# EAGLE design MotorBoardDev (EAGLE 8.4.0)
IGVC Motor Control Board
REVISION: v1.1; SCH_DESC: Motor Control Board; TEAM: IGVC

## Sheet 1 of 4: mBed Breakout
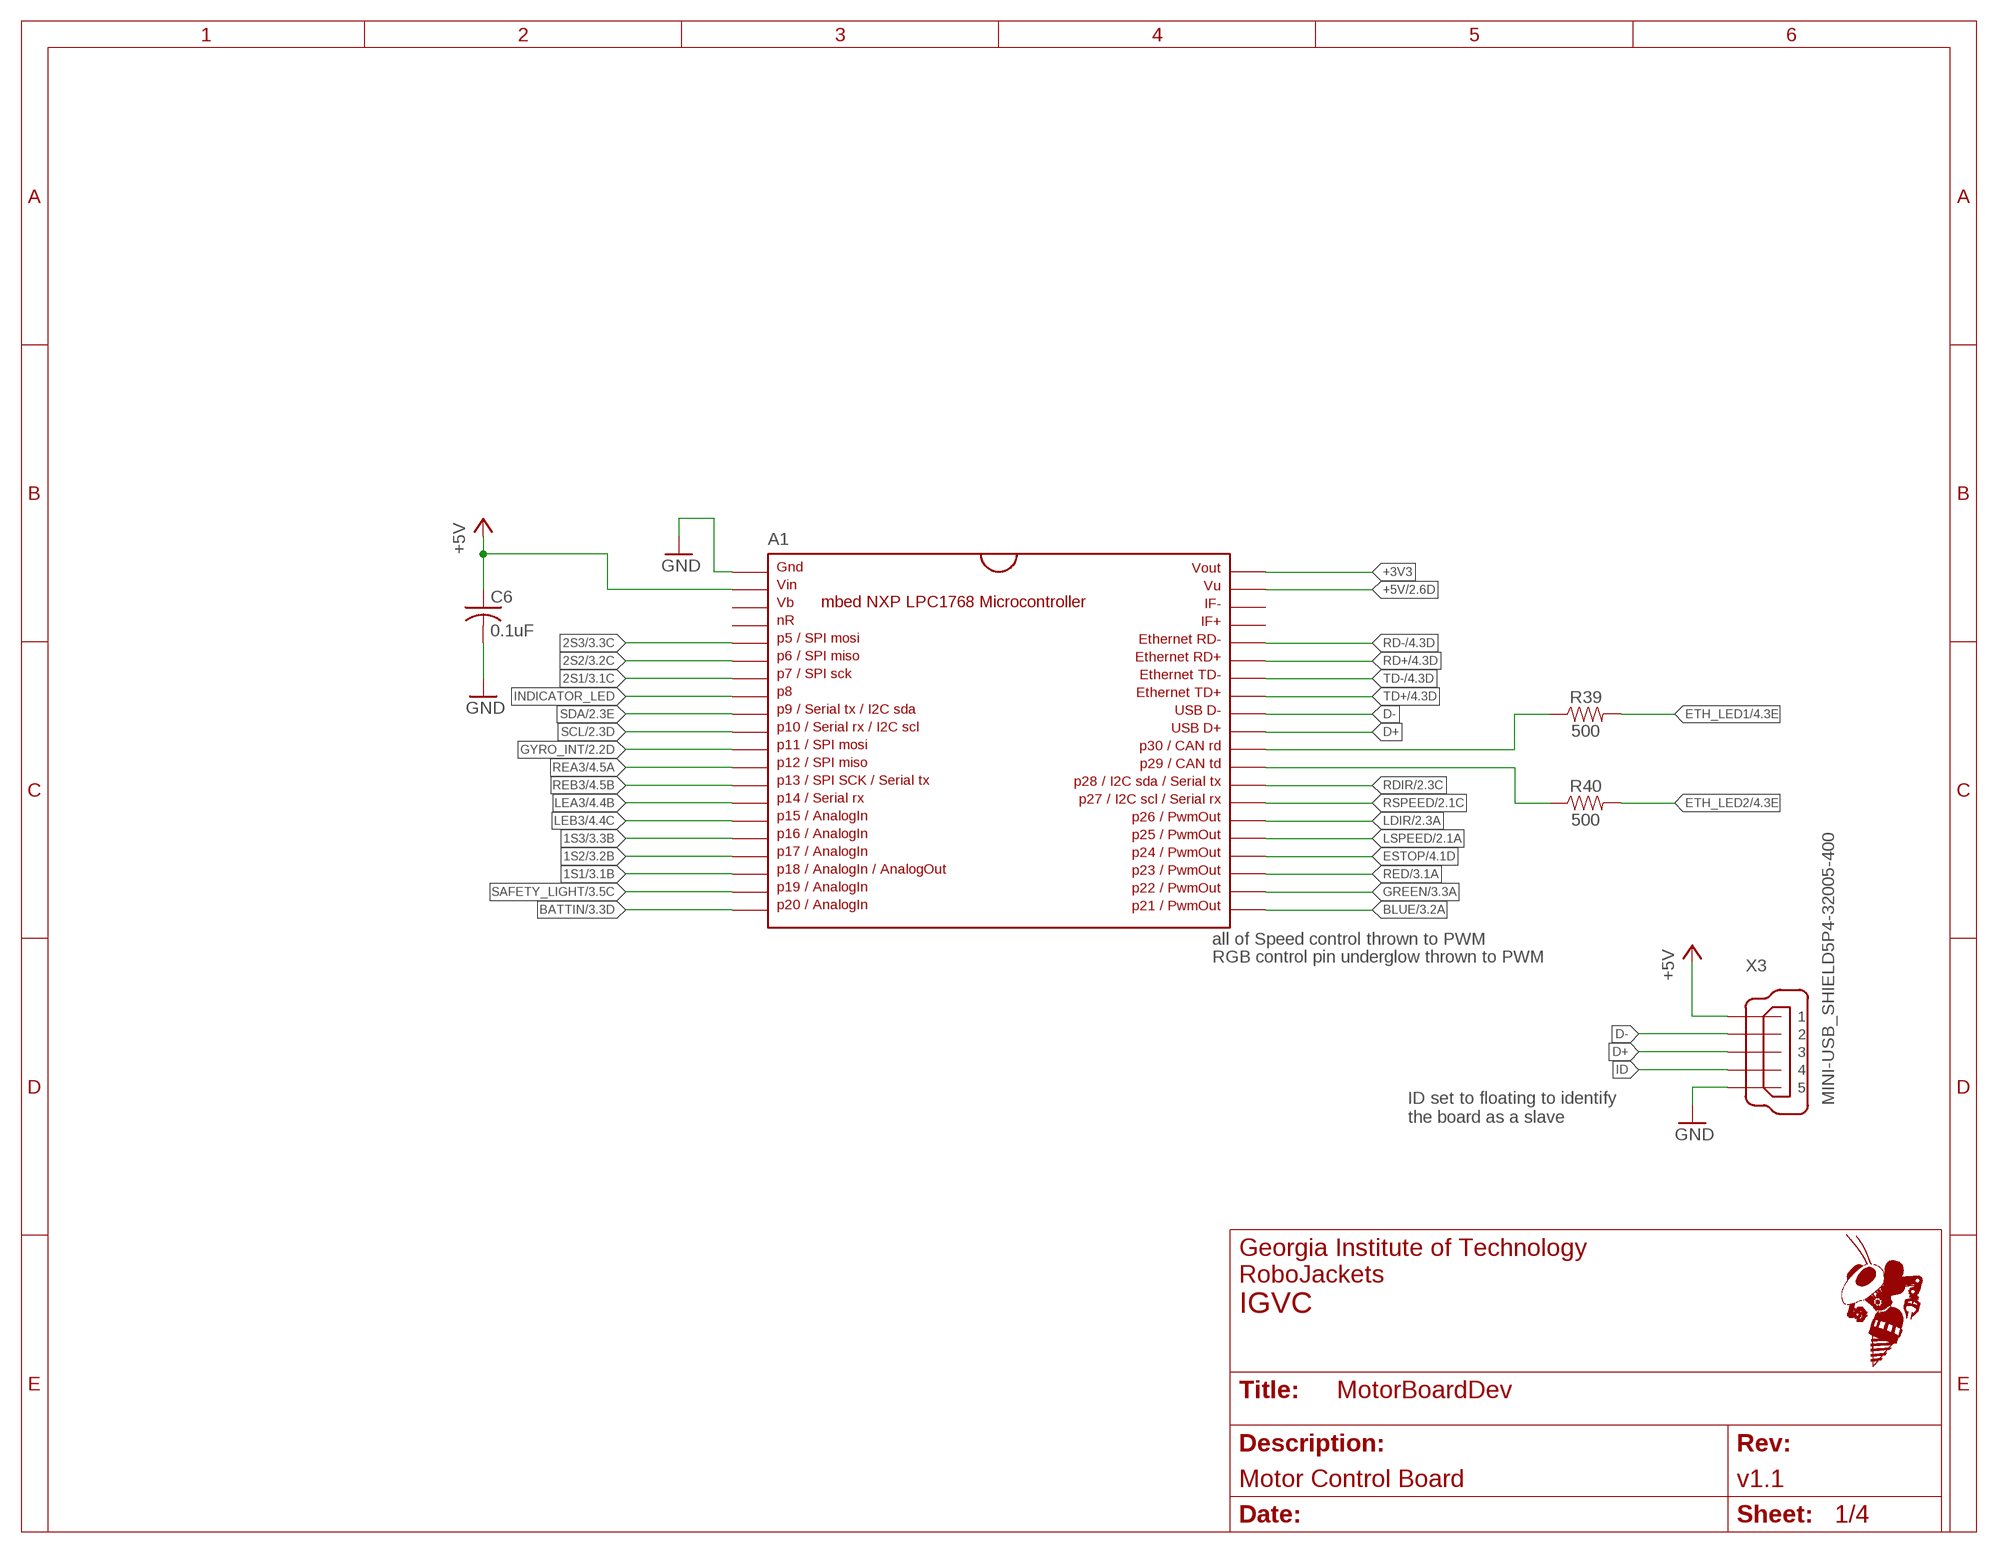
[diagram p0: schematic, sheet 1]

### Parts
A1  MBED1768  SPARKFUN-BOARDS_MBED_NXP_LPC1768  [SPARKFUN-BOARDS_DIL40_0.9]
C6  0.1uF  C-USC0603  [C0603]
R39  500  1KOHM-0603-1/10W-1%  [0603]
R40  500  1KOHM-0603-1/10W-1%  [0603]
X3  MINI-USB_SHIELD5P4-32005-400  [32005-400]

### Nets
1S1: A1.18 ; also sheet 3
1S2: A1.17 ; also sheet 3
1S3: A1.16 ; also sheet 3
2S1: A1.7 ; also sheet 3
2S2: A1.6 ; also sheet 3
2S3: A1.5 ; also sheet 3
+3V3: A1.40 ; also sheet 2,3,4
+5V: A1.2 A1.39 C6.1 X3.1 ; also sheet 2,3,4
BATTIN: A1.20 ; also sheet 3
BLUE: A1.21 ; also sheet 3
D+: A1.31 X3.3
D-: A1.32 X3.2
ESTOP: A1.24 ; also sheet 4
ETH_LED1: R39.2 ; also sheet 4
ETH_LED2: R40.2 ; also sheet 4
GND: A1.1 C6.2 X3.5 ; also sheet 2,3,4
GREEN: A1.22 ; also sheet 3
GYRO_INT: A1.11 ; also sheet 2
ID: X3.4
INDICATOR_LED: A1.8
LDIR: A1.26 ; also sheet 2
LEA3: A1.14 ; also sheet 4
LEB3: A1.15 ; also sheet 4
LSPEED: A1.25 ; also sheet 2
N$37: A1.30 R39.1
N$38: A1.29 R40.1
RD+: A1.35 ; also sheet 4
RD-: A1.36 ; also sheet 4
RDIR: A1.28 ; also sheet 2
REA3: A1.12 ; also sheet 4
REB3: A1.13 ; also sheet 4
RED: A1.23 ; also sheet 3
RSPEED: A1.27 ; also sheet 2
SAFETY_LIGHT: A1.19 ; also sheet 3
SCL: A1.10 ; also sheet 2
SDA: A1.9 ; also sheet 2
TD+: A1.33 ; also sheet 4
TD-: A1.34 ; also sheet 4
Unconnected: A1.3 A1.4 A1.37 A1.38 X3.M1(S1) X3.M2(S2) X3.M3(S3) X3.M4(S4)

### Notes on the sheet
- all of Speed control thrown to PWM
- RGB control pin underglow thrown to PWM
- ID set to floating to identify 
  the board as a slave

## Sheet 2 of 4: Motor Control
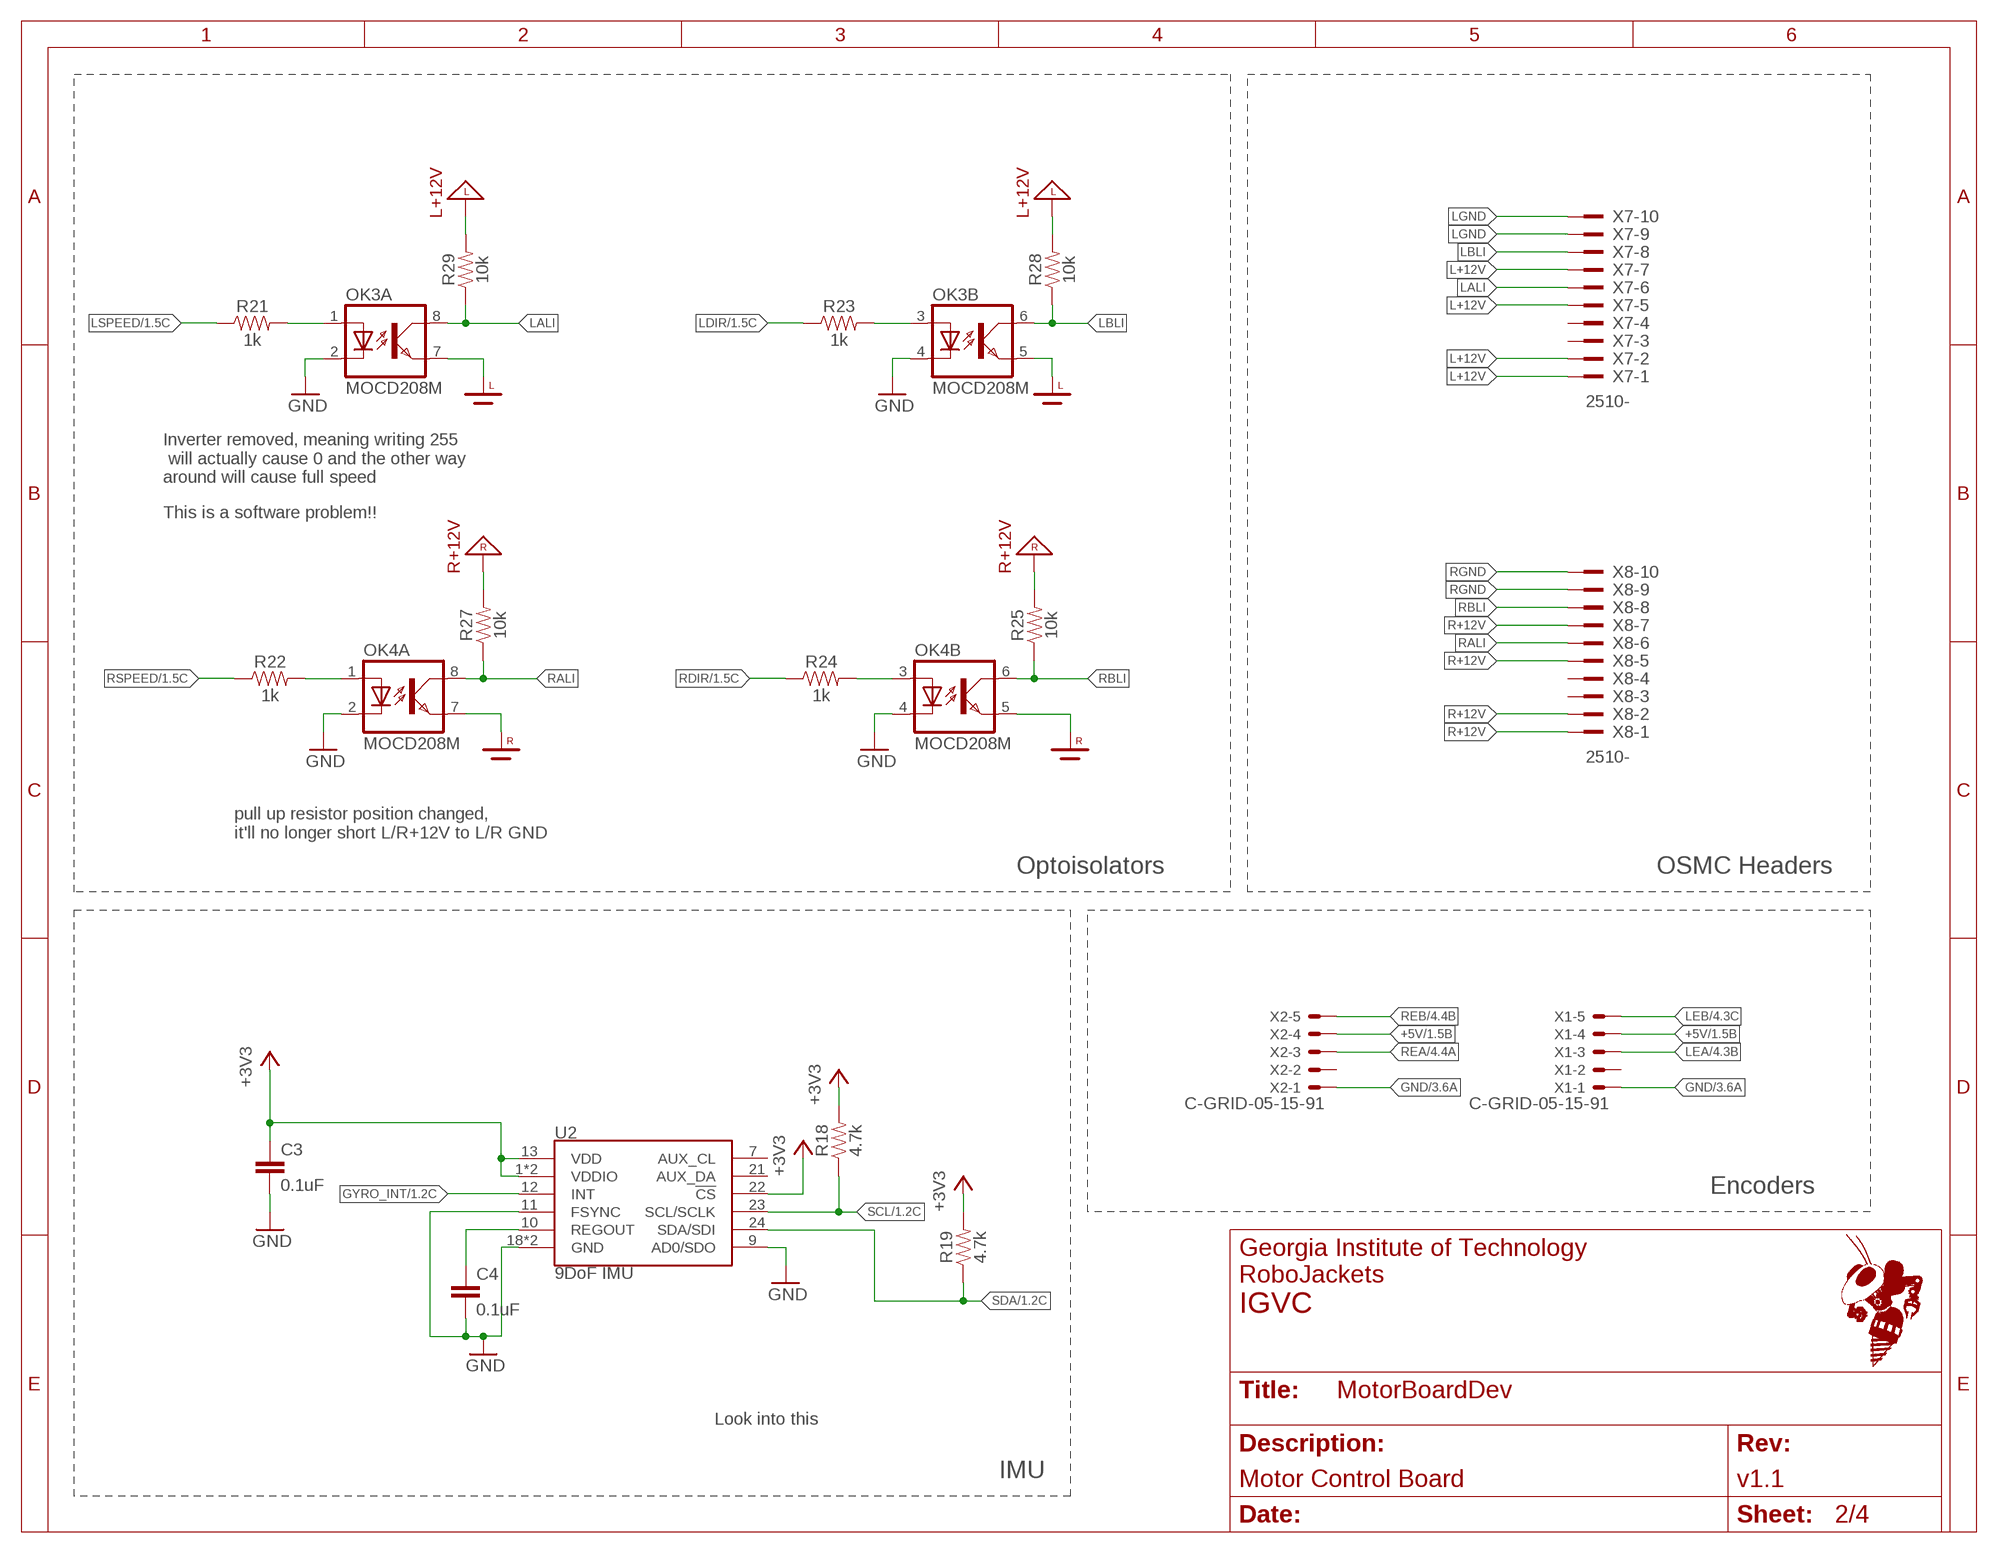
[diagram p1: schematic, sheet 2]

### Parts
C3  0.1uF  0.1UF-0603-25V-(+80/-20%)  [0603]
C4  0.1uF  0.1UF-0603-25V-(+80/-20%)  [0603]
OK3  MOCD208M  [SOIC08-FAIRCHILD]
OK4  MOCD208M  [SOIC08-FAIRCHILD]
R18  4.7k  4.7KOHM-0603-1/10W-1%  [0603]
R19  4.7k  4.7KOHM-0603-1/10W-1%  [0603]
R21  1k  1KOHM-0603-1/10W-1%  [0603]
R22  1k  1KOHM-0603-1/10W-1%  [0603]
R23  1k  1KOHM-0603-1/10W-1%  [0603]
R24  1k  1KOHM-0603-1/10W-1%  [0603]
R25  10k  10KOHM-0603-1/10W-1%  [0603]
R27  10k  10KOHM-0603-1/10W-1%  [0603]
R28  10k  10KOHM-0603-1/10W-1%  [0603]
R29  10k  10KOHM-0603-1/10W-1%  [0603]
U2  9DoF IMU  MPU-9250  [QFN24-3X3]
X1  C-GRID-05-15-91  [15-91-05]
X2  C-GRID-05-15-91  [15-91-05]
X7  2510-  [PAK100/2500-10]
X8  2510-  [PAK100/2500-10]

### Nets
+3V3: C3.1 R18.2 R19.2 U2.1(VDDIO) U2.8(VDDIO) U2.13(VDD) U2.22(!CS) ; also sheet 1,3,4
+5V: X1.4 X2.4 ; also sheet 1,3,4
GND: C3.2 C4.2 OK3.2(A:C) OK3.4(B:C) OK4.2(A:C) OK4.4(B:C) U2.9(AD0/SDO) U2.11(FSYNC) U2.18(GND) U2.20(GND) X1.1 X2.1 ; also sheet 1,3,4
GYRO_INT: U2.12(INT) ; also sheet 1
L+12V: R28.2 R29.2 X7.1 X7.2 X7.5 X7.7
LALI: OK3.8(A:COL) R29.1 X7.6
LBLI: OK3.6(B:COL) R28.1 X7.8
LDIR: R23.1 ; also sheet 1
LEA: X1.3 ; also sheet 4
LEB: X1.5 ; also sheet 4
LGND: OK3.5(B:EMIT) OK3.7(A:EMIT) X7.9 X7.10
LSPEED: R21.1 ; also sheet 1
N$2: C4.1 U2.10(REGOUT)
N$29: OK3.1(A:A) R21.2
N$30: OK4.1(A:A) R22.2
N$31: OK4.3(B:A) R24.2
N$32: OK3.3(B:A) R23.2
R+12V: R25.2 R27.2 X8.1 X8.2 X8.5 X8.7
RALI: OK4.8(A:COL) R27.1 X8.6
RBLI: OK4.6(B:COL) R25.1 X8.8
RDIR: R24.1 ; also sheet 1
REA: X2.3 ; also sheet 4
REB: X2.5 ; also sheet 4
RGND: OK4.5(B:EMIT) OK4.7(A:EMIT) X8.9 X8.10
RSPEED: R22.1 ; also sheet 1
SCL: R18.1 U2.23(SCL/SCLK) ; also sheet 1
SDA: R19.1 U2.24(SDA/SDI) ; also sheet 1
Unconnected: U2.7(AUX_CL) U2.21(AUX_DA) X1.2 X2.2 X7.3 X7.4 X8.3 X8.4

### Notes on the sheet
- Inverter removed, meaning writing 255
   will actually cause 0 and the other way 
  around will cause full speed
- This is a software problem!!
- pull up resistor position changed,
  it'll no longer short L/R+12V to L/R GND
- Optoisolators | OSMC Headers
- Encoders
- Look into this
- IMU

## Sheet 3 of 4: Light Control
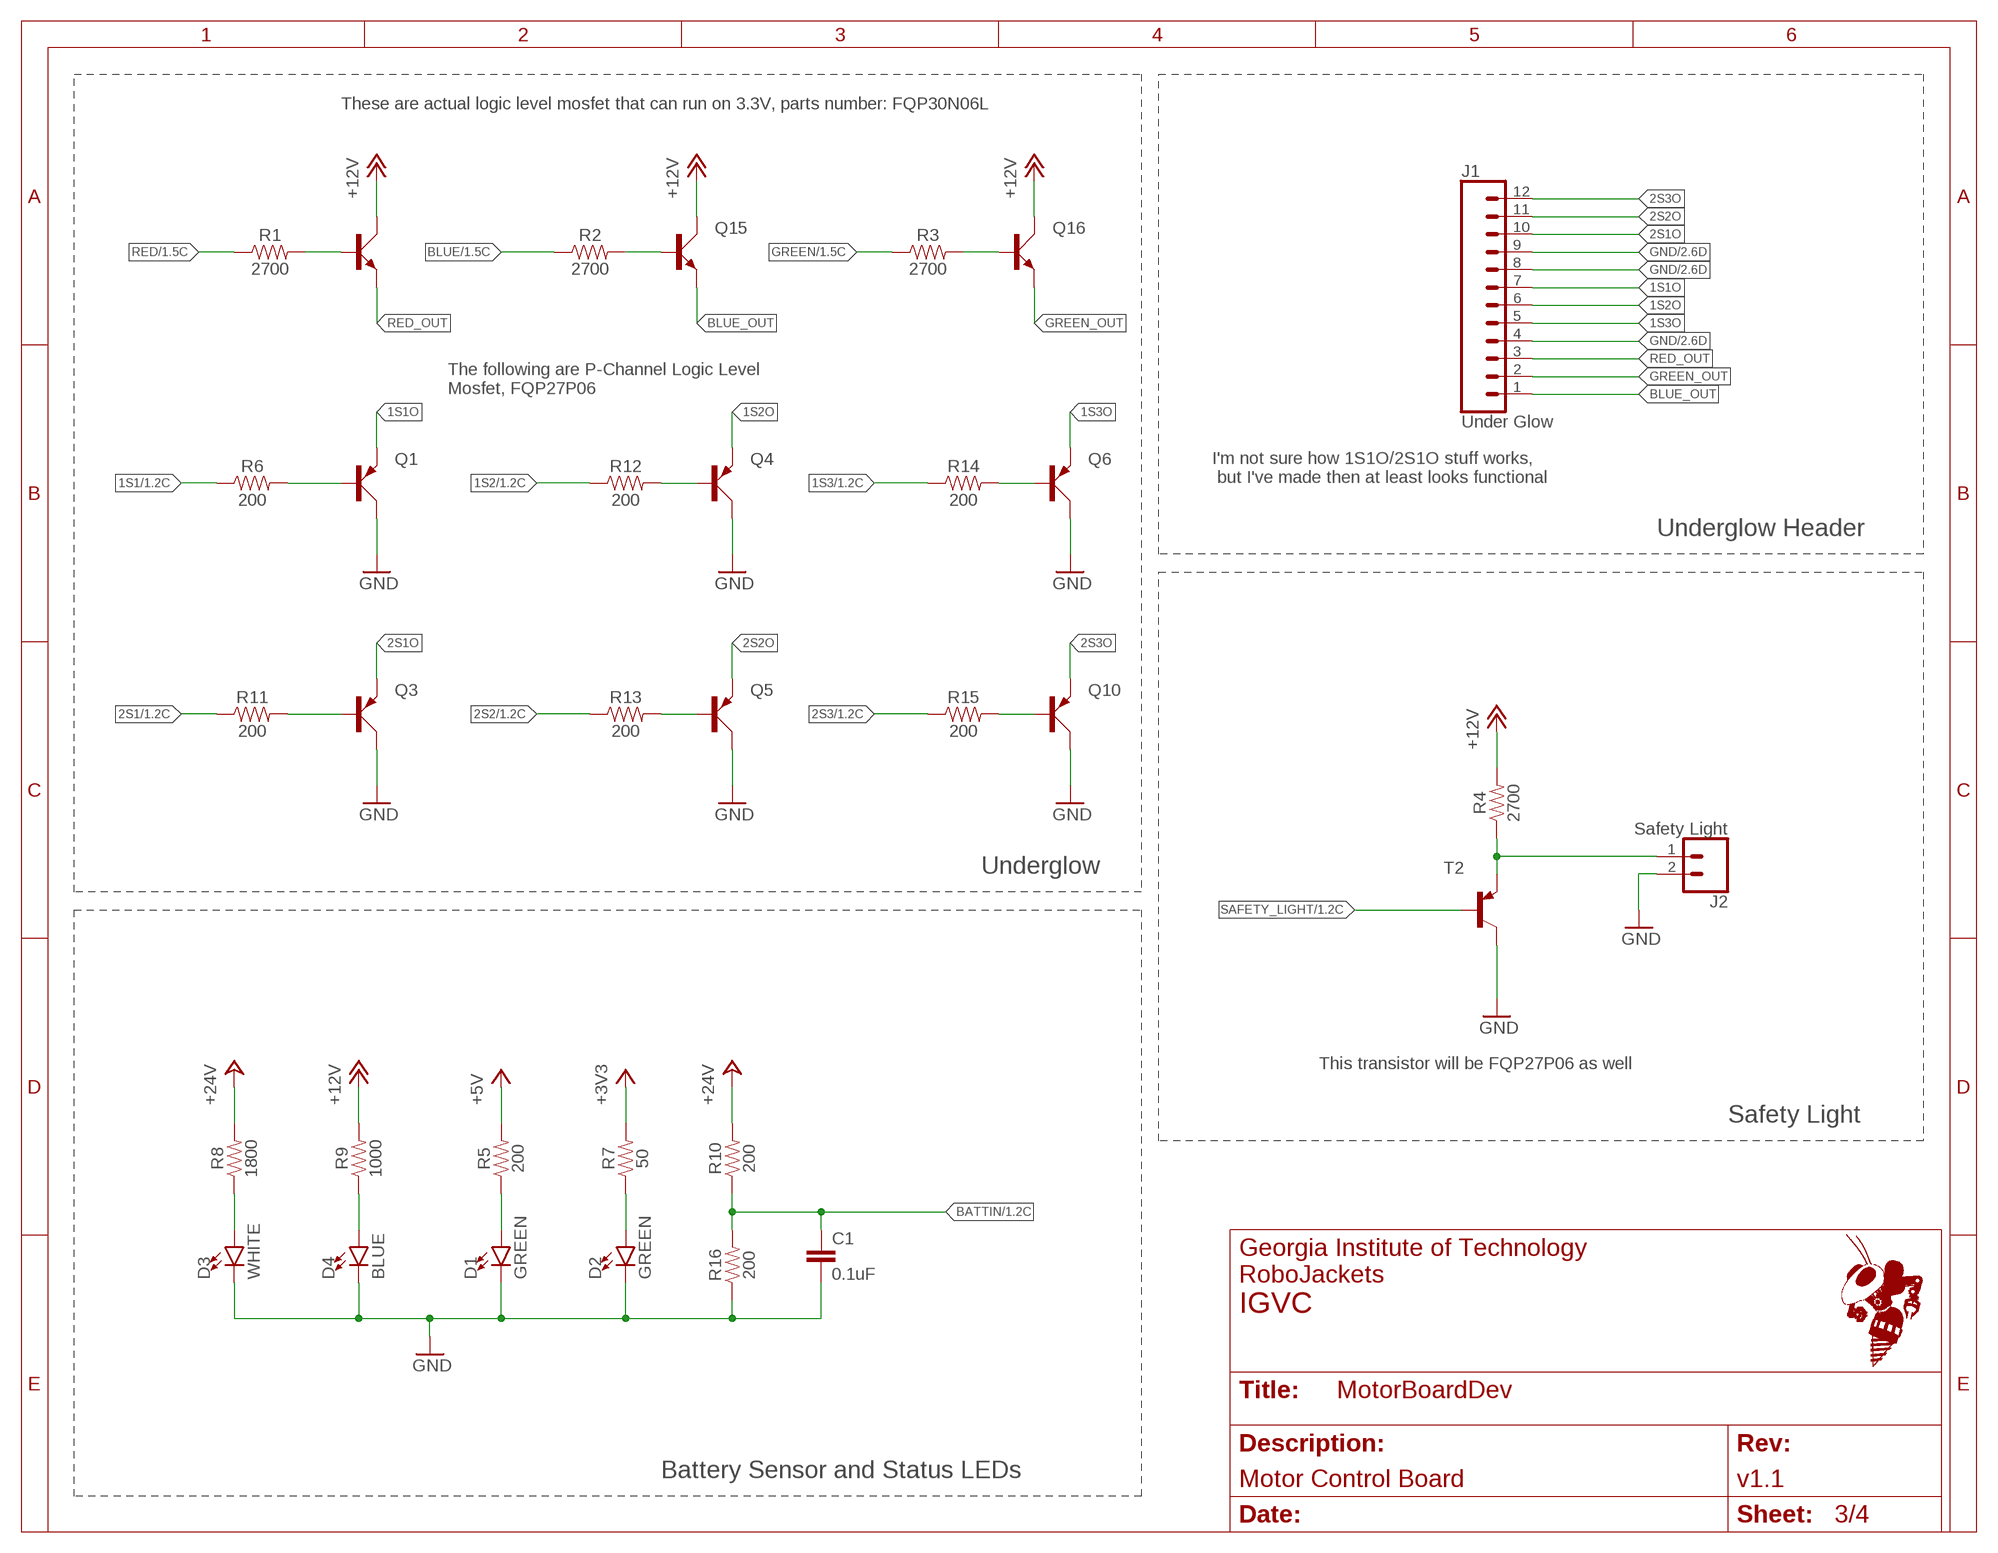
[diagram p2: schematic, sheet 3]

### Parts
C1  0.1uF  0.1UF-0603-100V-10%  [0603]
D1  GREEN  LED-GREEN0603  [LED-0603]
D2  GREEN  LED-GREEN0603  [LED-0603]
D3  WHITE  LED-WHITE0603  [LED-0603]
D4  BLUE  LED-BLUE0603  [LED-0603]
FQP30N06L  TIP41C  [TO220AV]
J1  Under Glow  CONN_12LOCK_LONGPADS  [1X12_LOCK_LONGPADS]
J2  Safety Light  CONN_02POLAR  [MOLEX-1X2]
Q1  TIP42C  [TO220AV]
Q3  TIP42C  [TO220AV]
Q4  TIP42C  [TO220AV]
Q5  TIP42C  [TO220AV]
Q6  TIP42C  [TO220AV]
Q10  TIP42C  [TO220AV]
Q15  TIP41C  [TO220AV]
Q16  TIP41C  [TO220AV]
R1  2700  2.55KOHM-0603-1/10W-1%  [0603]
R2  2700  2.55KOHM-0603-1/10W-1%  [0603]
R3  2700  2.55KOHM-0603-1/10W-1%  [0603]
R4  2700  3.9KOHM-0603-1/10W-1%  [0603]
R5  200  200OHM-0603-1/10W-1%  [0603]
R6  200  200OHM-0603-1/10W-1%  [0603]
R7  50  200OHM-0603-1/10W-1%  [0603]
R8  1800  200OHM-0603-1/10W-1%  [0603]
R9  1000  200OHM-0603-1/10W-1%  [0603]
R10  200  200OHM-0603-1/10W-1%  [0603]
R11  200  200OHM-0603-1/10W-1%  [0603]
R12  200  200OHM-0603-1/10W-1%  [0603]
R13  200  200OHM-0603-1/10W-1%  [0603]
R14  200  200OHM-0603-1/10W-1%  [0603]
R15  200  200OHM-0603-1/10W-1%  [0603]
R16  200  200OHM-0603-1/10W-1%  [0603]
T2  TIP41A  -PNP-TO220V  [TO220V]

### Nets
1S1: R6.1 ; also sheet 1
1S1O: J1.7 Q1.E
1S2: R12.1 ; also sheet 1
1S2O: J1.6 Q4.E
1S3: R14.1 ; also sheet 1
1S3O: J1.5 Q6.E
2S1: R11.1 ; also sheet 1
2S1O: J1.10 Q3.E
2S2: R13.1 ; also sheet 1
2S2O: J1.11 Q5.E
2S3: R15.1 ; also sheet 1
2S3O: J1.12 Q10.E
+3V3: R7.2 ; also sheet 1,2,4
+5V: R5.2 ; also sheet 1,2,4
+12V: FQP30N06L.C Q15.C Q16.C R4.2 R9.2 ; also sheet 4
+24V: R8.2 R10.2 ; also sheet 4
BATTIN: C1.1 R10.1 R16.2 ; also sheet 1
BLUE: R2.1 ; also sheet 1
BLUE_OUT: J1.1 Q15.E
GND: C1.2 D1.C D2.C D3.C D4.C J1.4 J1.8 J1.9 J2.2 Q1.C Q3.C Q4.C Q5.C Q6.C Q10.C R16.1 T2.2(C) ; also sheet 1,2,4
GREEN: R3.1 ; also sheet 1
GREEN_OUT: J1.2 Q16.E
N$1: J2.1 R4.1 T2.3(E)
N$3: FQP30N06L.B R1.2
N$4: Q15.B R2.2
N$5: D1.A R5.1
N$6: D2.A R7.1
N$9: D3.A R8.1
N$10: Q16.B R3.2
N$11: Q6.B R14.2
N$12: D4.A R9.1
N$13: Q4.B R12.2
N$14: Q1.B R6.2
N$15: Q3.B R11.2
N$16: Q5.B R13.2
N$28: Q10.B R15.2
RED: R1.1 ; also sheet 1
RED_OUT: FQP30N06L.E J1.3
SAFETY_LIGHT: T2.1(B) ; also sheet 1

### Notes on the sheet
- These are actual logic level mosfet that can run on 3.3V, parts number: FQP30N06L
- The following are P-Channel Logic Level
  Mosfet, FQP27P06
- I'm not sure how 1S1O/2S1O stuff works,
   but I've made then at least looks functional
- Underglow Header
- Underglow
- This transistor will be FQP27P06 as well
- Safety Light
- Battery Sensor and Status LEDs

## Sheet 4 of 4: Misc. Power and Headers
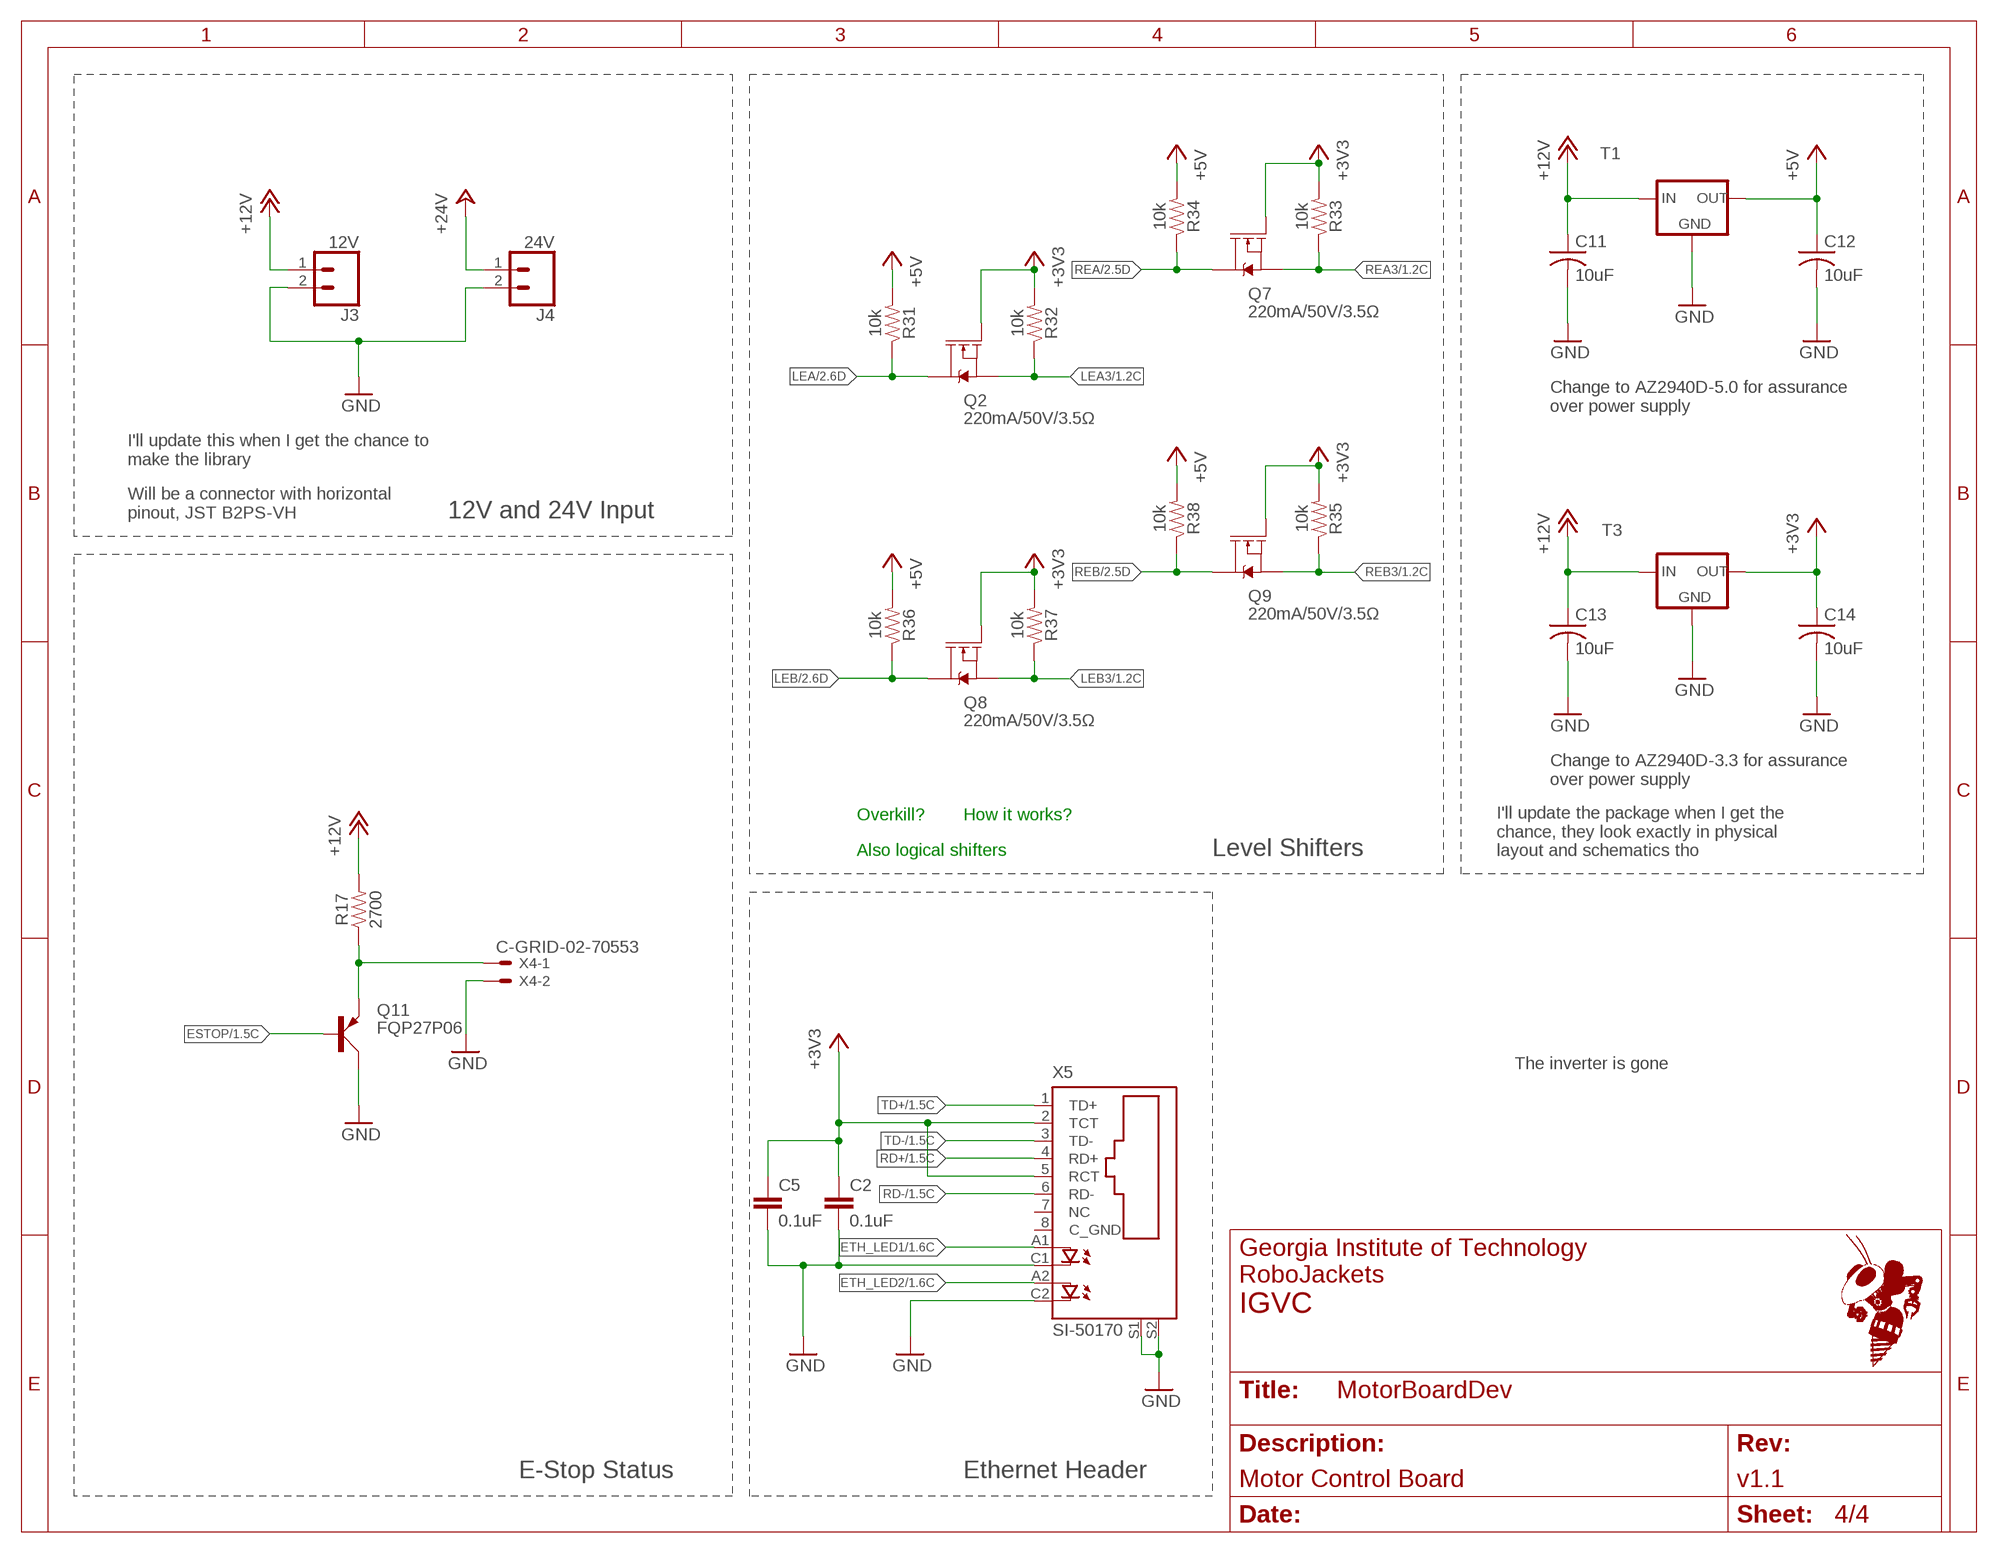
[diagram p3: schematic, sheet 4]

### Parts
C2  0.1uF  0.1UF-0603-25V-(+80/-20%)  [0603]
C5  0.1uF  0.1UF-0603-25V-(+80/-20%)  [0603]
C11  10uF  C-USC0805  [C0805]
C12  10uF  C-USC0805  [C0805]
C13  10uF  C-USC0805  [C0805]
C14  10uF  C-USC0805  [C0805]
J3  12V  CONN_025MM  [SCREWTERMINAL-5MM-2]
J4  24V  CONN_025MM  [SCREWTERMINAL-5MM-2]
Q2  220mA/50V/3.5Ω  MOSFET-NCH-BSS138  [SOT23-3]
Q7  220mA/50V/3.5Ω  MOSFET-NCH-BSS138  [SOT23-3]
Q8  220mA/50V/3.5Ω  MOSFET-NCH-BSS138  [SOT23-3]
Q9  220mA/50V/3.5Ω  MOSFET-NCH-BSS138  [SOT23-3]
Q11  TIP42C  [TO220AV]
R17  2700  3.9KOHM-0603-1/10W-1%  [0603]
R31  10k  10KOHM-0603-1/10W-1%  [0603]
R32  10k  10KOHM-0603-1/10W-1%  [0603]
R33  10k  10KOHM-0603-1/10W-1%  [0603]
R34  10k  10KOHM-0603-1/10W-1%  [0603]
R35  10k  10KOHM-0603-1/10W-1%  [0603]
R36  10k  10KOHM-0603-1/10W-1%  [0603]
R37  10k  10KOHM-0603-1/10W-1%  [0603]
R38  10k  10KOHM-0603-1/10W-1%  [0603]
T1  NCP1117DT50GOS-ND  [TO252]
T3  NCP1117DT33GOS-ND  [TO252]
X4  C-GRID-02-70553  [70553-02]
X5  SI-50170  [SI-50170]

### Nets
+3V3: C2.1 C5.1 C14.1 Q2.1(G) Q7.1(G) Q8.1(G) Q9.1(G) R32.2 R33.2 R35.2 R37.2 T3.2(OUT) X5.2(TCT) X5.5(RCT) ; also sheet 1,2,3
+5V: C12.1 R31.2 R34.2 R36.2 R38.2 T1.2(OUT) ; also sheet 1,2,3
+12V: C11.1 C13.1 J3.1 R17.2 T1.3(IN) T3.3(IN) ; also sheet 3
+24V: J4.1 ; also sheet 3
ESTOP: Q11.B ; also sheet 1
ETH_LED1: X5.A1(A) ; also sheet 1
ETH_LED2: X5.A2(A1) ; also sheet 1
GND: C2.2 C5.2 C11.2 C12.2 C13.2 C14.2 J3.2 J4.2 Q11.C T1.1(GND) T3.1(GND) X4.2 X5.C1(C) X5.C2(C1) X5.S1 X5.S2 ; also sheet 1,2,3
LEA: Q2.3(D) R31.1 ; also sheet 2
LEA3: Q2.2(S) R32.1 ; also sheet 1
LEB: Q8.3(D) R36.1 ; also sheet 2
LEB3: Q8.2(S) R37.1 ; also sheet 1
N$8: Q11.E R17.1 X4.1
RD+: X5.4(RD+) ; also sheet 1
RD-: X5.6(RD-) ; also sheet 1
REA: Q7.3(D) R34.1 ; also sheet 2
REA3: Q7.2(S) R33.1 ; also sheet 1
REB: Q9.3(D) R38.1 ; also sheet 2
REB3: Q9.2(S) R35.1 ; also sheet 1
TD+: X5.1(TD+) ; also sheet 1
TD-: X5.3(TD-) ; also sheet 1
Unconnected: X5.7(NC) X5.8(C_GND)

### Notes on the sheet
- Change to AZ2940D-5.0 for assurance 
  over power supply
- I'll update this when I get the chance to 
  make the library
- Will be a connector with horizontal 
  pinout, JST B2PS-VH
- 12V and 24V Input
- Change to AZ2940D-3.3 for assurance 
  over power supply
- Overkill? | How it works?
- Also logical shifters | Level Shifters
- I'll update the package when I get the
  chance, they look exactly in physical
  layout and schematics tho
- FQP27P06
- The inverter is gone
- E-Stop Status | Ethernet Header

## Library data of the parts
A1 = MotorBoardDev:SPARKFUN-BOARDS_MBED_NXP_LPC1768: mbed LPC1768 board footprint Boards using this footprint: mbed - LPC1768 (Cortex-M3) (DEV-09564); PROD_ID: COMP-12167
C1 = SparkFun-Capacitors:0.1UF: 0.1µF ceramic capacitors A capacitor is a passive two-terminal electrical component used to store electrical energy temporarily in an electric field.; PROD_ID: CAP-08390
C2-C5 = SparkFun-Capacitors:0.1UF: 0.1µF ceramic capacitors A capacitor is a passive two-terminal electrical component used to store electrical energy temporarily in an electric field.; PROD_ID: CAP-00810
C6 C11-C14 = rcl:C-US: CAPACITOR, American symbol
D1 D2 = SparkFun-LED:LED-GREEN: Green SMD LED Used in manufacturing of various products at SparkFun Packages: 0603 - SMD 0603 package [Product Link] <http://www.futureelectronics.com/en/technologies/semiconductors/optoelectronics/leds/Pages/9894312-LTST-C190GKT.aspx?CrossPart=HSMG-C190&IM=0> LilyPad 1206 - SMD1206 LilyPad package [Product Link] <http://www.futureelectronics.com/en/Technologies/Product.aspx?ProductID=IN150NGHARVATEKCORPORATION2049943&IM=0> 1206 - SMD1206 package [Product Link] <http://www.futureelectronics.com/en/technologies/semiconductors/optoelectronics/leds/Pages/8315665-LTST-C150KGKT.aspx?IM=0> 1206 Bottom Mount -SMD 1206 Bottom Mount [Product Link] <http://www.digikey.com/product-detail/en/lite-on-inc/LTST-C230KGKT/160-1456-1-ND/386854> SparkFun Products: Pro Mini 328 -5V <https://www.sparkfun.com/products/821> RedBoard <https://www.sparkfun.com/products/12757> MP3 Trigger <https://www.sparkfun.com/products/13720> Makey Makey <https://www.sparkfun.com/products/11076>; PROD_ID: DIO-00821
D3 = SparkFun-LED:LED-WHITE: White SMD LED Used in manufacturing several products at SparkFun. Packages: 0603 - Bright White SMD 0603 package[Product Link] <http://www.kingbrightusa.com/product.asp?catalog_name=LED&product_id=APT1608QWF/D> 1206 - Bright White SMD1206 package [Product Link] <http://www.kingbrightusa.com/product.asp?catalog_name=LED&product_id=APT3216QWF/D> 3014 - Super Bright SMD 3014 package [Datasheet] <http://www.lumileds.com/uploads/459/DS208-pdf> SparkFun Products: Blackberry Trackballer Breakout <https://www.sparkfun.com/products/13169> Digital SandBox <https://www.sparkfun.com/products/12651>; PROD_ID: DIO-09004
D4 = SparkFun-LED:LED-BLUE: Blue SMD LED Used in manufacturing of various products at SparkFun Packages: 0603 - SMD 0603 package [Product Link] <http://www.digikey.com/product-detail/en/SMLE12BC7TT86/511-1589-2-ND/1641808> 1206 - SMD1206 package [Product Link] <http://www.digikey.com/product-detail/en/lite-on-inc/LTST-C150TBKT/160-1643-1-ND/573584> SparkFun Products: ESP8266 Thing-Dev Board <https://www.sparkfun.com/products/13711> RedBoard <https://www.sparkfun.com/products/12757>; PROD_ID: DIO-08575
FQP30N06L Q15 Q16 = transistor-power:TIP41C: NPN TRANSISTOR
J1 = SparkFun-Connectors:CONN_12: Multi connection point. Often used as Generic Header-pin footprint for 0.1 inch spaced/style header connections On any of the 0.1 inch spaced packages, you can populate with these: Break Away Headers - Straight <https://www.sparkfun.com/products/116> (PRT-00116) Break Away Male Headers - Right Angle <https://www.sparkfun.com/products/553> (PRT-00553) Female Headers <https://www.sparkfun.com/products/115> (PRT-00115) Break Away Headers - Machine Pin <https://www.sparkfun.com/products/117> (PRT-00117) Break Away Female Headers - Swiss Machine Pin <https://www.sparkfun.com/products/743> (PRT-00743) For SCREWTERMINALS and SPRING TERMINALS visit here: Screw Terimnals on SparkFun.com <https://www.sparkfun.com/search/results?term=Screw+Terminals> (5mm/3.5mm/2.54mm spacing) This device is also useful as a general connection point to wire up your design to another part of your project. Our various solder wires solder well into these plated through hole pads. Hook-Up Wire - Assortment (Stranded, 22 AWG) <https://www.sparkfun.com/products/11375> (PRT-11375) Hook-Up Wire - Assortment (Solid Core, 22 AWG) <https://www.sparkfun.com/products/11367> (PRT-11367) View the entire wire category on our website here <https://www.sparkfun.com/categories/141> Special notes: Molex polarized connector foot print use with SKU : PRT-08231 with associated crimp pins and housings. 1MM SMD Version SKU: PRT-10208 NOTES ON THE VARIANTS LOCK and LOCK_LONGPADS... This footprint was designed to help hold the alignment of a through-hole component (i.e. 6-pin header) while soldering it into place. You may notice that each hole has been shifted either up or down by 0.005 of an inch from it's more standard position (which is a perfectly straight line). This slight alteration caused the pins (the squares in the middle) to touch the edges of the holes. Because they are alternating, it causes a "brace" to hold the component in place. 0.005 has proven to be the perfect amount of "off-center" position when using our standard breakaway headers. Although looks a little odd when you look at the bare footprint, once you have a header in there, the alteration is very hard to notice. Also,if you push a header all the way into place, it is covered up entirely on the bottom side.
J2 = SparkFun-Retired:CONN_02: Multi connection point. Often used as Generic Header-pin footprint for 0.1 inch spaced/style header connections On any of the 0.1 inch spaced packages, you can populate with these: Break Away Headers - Straight <https://www.sparkfun.com/products/116> (PRT-00116) Break Away Male Headers - Right Angle <https://www.sparkfun.com/products/553> (PRT-00553) Female Headers <https://www.sparkfun.com/products/115> (PRT-00115) Break Away Headers - Machine Pin <https://www.sparkfun.com/products/117> (PRT-00117) Break Away Female Headers - Swiss Machine Pin <https://www.sparkfun.com/products/743> (PRT-00743) For SCREWTERMINALS and SPRING TERMINALS visit here: Screw Terimnals on SparkFun.com <https://www.sparkfun.com/search/results?term=Screw+Terminals> (5mm/3.5mm/2.54mm spacing) This device is also useful as a general connection point to wire up your design to another part of your project. Our various solder wires solder well into these plated through hole pads. Hook-Up Wire - Assortment (Stranded, 22 AWG) <https://www.sparkfun.com/products/11375> (PRT-11375) Hook-Up Wire - Assortment (Solid Core, 22 AWG) <https://www.sparkfun.com/products/11367> (PRT-11367) View the entire wire category on our website here <https://www.sparkfun.com/categories/141> Special notes: Molex polarized connector foot print use with: PRT-08233 with associated crimp pins and housings. 2.54_SCREWTERM for use with PRT-10571. 3.5mm Screw Terminal footprints for PRT-08084 5mm Screw Terminal footprints for use with PRT-08432; SF_ID: PRT-09918
J3 J4 = SparkFun-Connectors:CONN_02: Multi connection point. Often used as Generic Header-pin footprint for 0.1 inch spaced/style header connections On any of the 0.1 inch spaced packages, you can populate with these: Break Away Headers - Straight <https://www.sparkfun.com/products/116> (PRT-00116) Break Away Male Headers - Right Angle <https://www.sparkfun.com/products/553> (PRT-00553) Female Headers <https://www.sparkfun.com/products/115> (PRT-00115) Break Away Headers - Machine Pin <https://www.sparkfun.com/products/117> (PRT-00117) Break Away Female Headers - Swiss Machine Pin <https://www.sparkfun.com/products/743> (PRT-00743) For SCREWTERMINALS and SPRING TERMINALS visit here: Screw Terimnals on SparkFun.com <https://www.sparkfun.com/search/results?term=Screw+Terminals> (5mm/3.5mm/2.54mm spacing) This device is also useful as a general connection point to wire up your design to another part of your project. Our various solder wires solder well into these plated through hole pads. Hook-Up Wire - Assortment (Stranded, 22 AWG) <https://www.sparkfun.com/products/11375> (PRT-11375) Hook-Up Wire - Assortment (Solid Core, 22 AWG) <https://www.sparkfun.com/products/11367> (PRT-11367) View the entire wire category on our website here <https://www.sparkfun.com/categories/141> Special notes: Molex polarized connector foot print use with: PRT-08233 with associated crimp pins and housings. 2.54_SCREWTERM for use with PRT-10571. 3.5mm Screw Terminal footprints for PRT-08084 5mm Screw Terminal footprints for use with PRT-08432; SF_SKU: PRT-08432
OK3 OK4 = optocoupler:MOCD20*M: MOCD207M, MOCD208M Dual Channel Phototransistor Small Outline Surface Mount Optocouplers Source: Data sheet <http://www.fairchildsemi.com/ds/MO%2FMOCD207-M.pdf>; MF: FAIRCHILD SEMICONDUCTOR; MPN: MOCD208M; OC_FARNELL: 1505465; OC_NEWARK: 34C7498
Q1 Q3-Q6 Q10 Q11 = transistor-power:TIP42C: PNP TRANSISTOR
Q2 Q7-Q9 = SparkFun-DiscreteSemi:MOSFET-NCH: N-channel MOSFETs Voltage controlled devices that allow control of high current outputs. SparkFun Products: SparkFun OpenScale <https://www.sparkfun.com/products/13261> SparkFun Digital Sandbox <https://www.sparkfun.com/products/12651> SparkFun Monster Moto Shield <https://www.sparkfun.com/products/10182> SparkFun MOSFET Power Controller <https://www.sparkfun.com/products/11214>; PROD_ID: TRANS-00830
R1-R3 = SparkFun-Resistors:2.55KOHM: 2.55kΩ resistor A resistor is a passive two-terminal electrical component that implements electrical resistance as a circuit element. Resistors act to reduce current flow, and, at the same time, act to lower voltage levels within circuits. - Wikipedia; PROD_ID: RES-11227; VALUE: 2.55k
R4 R17 = SparkFun-Resistors:3.9KOHM: 3.9kΩ resistor A resistor is a passive two-terminal electrical component that implements electrical resistance as a circuit element. Resistors act to reduce current flow, and, at the same time, act to lower voltage levels within circuits. - Wikipedia; PROD_ID: RES-08701; VALUE: 3.9k
R5 R6 R10-R16 = SparkFun-Resistors:200OHM: 200Ω resistor A resistor is a passive two-terminal electrical component that implements electrical resistance as a circuit element. Resistors act to reduce current flow, and, at the same time, act to lower voltage levels within circuits. - Wikipedia; PROD_ID: RES-08220
R7-R9 = SparkFun-Resistors:200OHM: 200Ω resistor A resistor is a passive two-terminal electrical component that implements electrical resistance as a circuit element. Resistors act to reduce current flow, and, at the same time, act to lower voltage levels within circuits. - Wikipedia; PROD_ID: RES-08220; VALUE: 200
R18 R19 = SparkFun-Resistors:4.7KOHM: 4.7kΩ resistor A resistor is a passive two-terminal electrical component that implements electrical resistance as a circuit element. Resistors act to reduce current flow, and, at the same time, act to lower voltage levels within circuits. - Wikipedia; PROD_ID: RES-07857
R21-R24 = SparkFun-Resistors:1KOHM: 1kΩ resistor A resistor is a passive two-terminal electrical component that implements electrical resistance as a circuit element. Resistors act to reduce current flow, and, at the same time, act to lower voltage levels within circuits. - Wikipedia; PROD_ID: RES-07856
R25 R27-R29 R31-R38 = SparkFun-Resistors:10KOHM: 10kΩ resistor A resistor is a passive two-terminal electrical component that implements electrical resistance as a circuit element. Resistors act to reduce current flow, and, at the same time, act to lower voltage levels within circuits. - Wikipedia; PROD_ID: RES-00824
R39 R40 = SparkFun-Resistors:1KOHM: 1kΩ resistor A resistor is a passive two-terminal electrical component that implements electrical resistance as a circuit element. Resistors act to reduce current flow, and, at the same time, act to lower voltage levels within circuits. - Wikipedia; PROD_ID: RES-07856; VALUE: 1k
T1 = IGVC-Regulators:NCP1117DT50GOS-ND
T2 = transistor:*-PNP-: PNP Transistror
T3 = IGVC-Regulators:NCP1117DT33GOS-ND
U2 = SparkFun-Sensors:MPU-9250: MPU-9250 9 Degree of Freedom IMU System in Package that contains MPU-6500 & AK8963 NC pin 19. 2-6 & 14-17 not internally connected. May be used for PCB trace routing. Datasheet <https://cdn.sparkfun.com/assets/learn_tutorials/5/5/0/MPU9250REV1.0.pdf> SparkFun Products: SparkFun 9DoF Razor IMU M0 <https://www.sparkfun.com/products/14001> SparkFun IMU Breakout - MPU-9250 <https://www.sparkfun.com/products/13762>; PROD_ID: IC-13192
X1 X2 = con-molex:C-GRID-05: CONNECTOR wire to board 2.54 mm (0.100") pitch header; OC_FARNELL: unknown; OC_NEWARK: unknown
X3 = con-cypressindustries:MINI-USB_SHIELD5P4-: MINI USB-B R/A W/O POST 5 pol. Source: www.cypressindustries.com; OC_FARNELL: unknown; OC_NEWARK: unknown
X4 = con-molex:C-GRID-02: CONNECTOR wire to board 2.54 mm (0.100") pitch header; OC_FARNELL: unknown; OC_NEWARK: unknown
X5 = con-stewart:SI-50170: Ethernet Connector MagJack (R) Source: www.stewartconnector.com .. si-50170.pdf; OC_FARNELL: unknown; OC_NEWARK: unknown
X7 X8 = con-3m:2510-: 3M (TM) Pak 100 4-Wall Header Source: 3M; MF: 3M; MPN: 2510-6002UB; OC_FARNELL: 9838244; OC_NEWARK: 46F4725

## Board
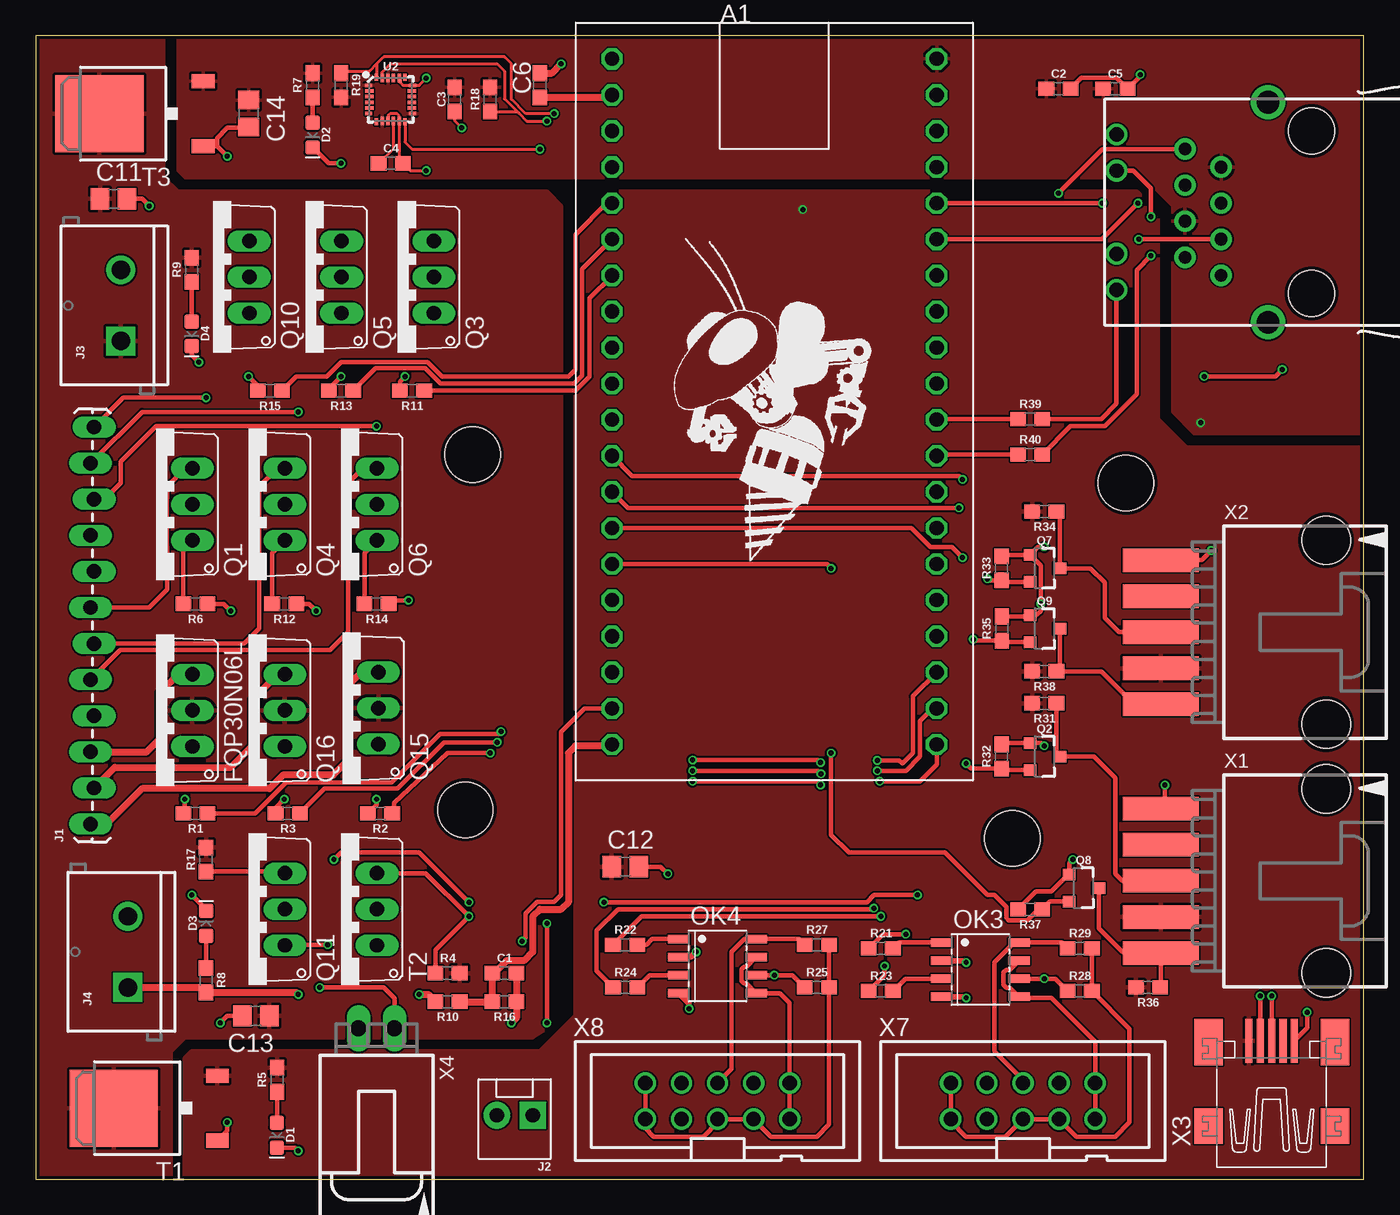
[diagram p4: board, top side]
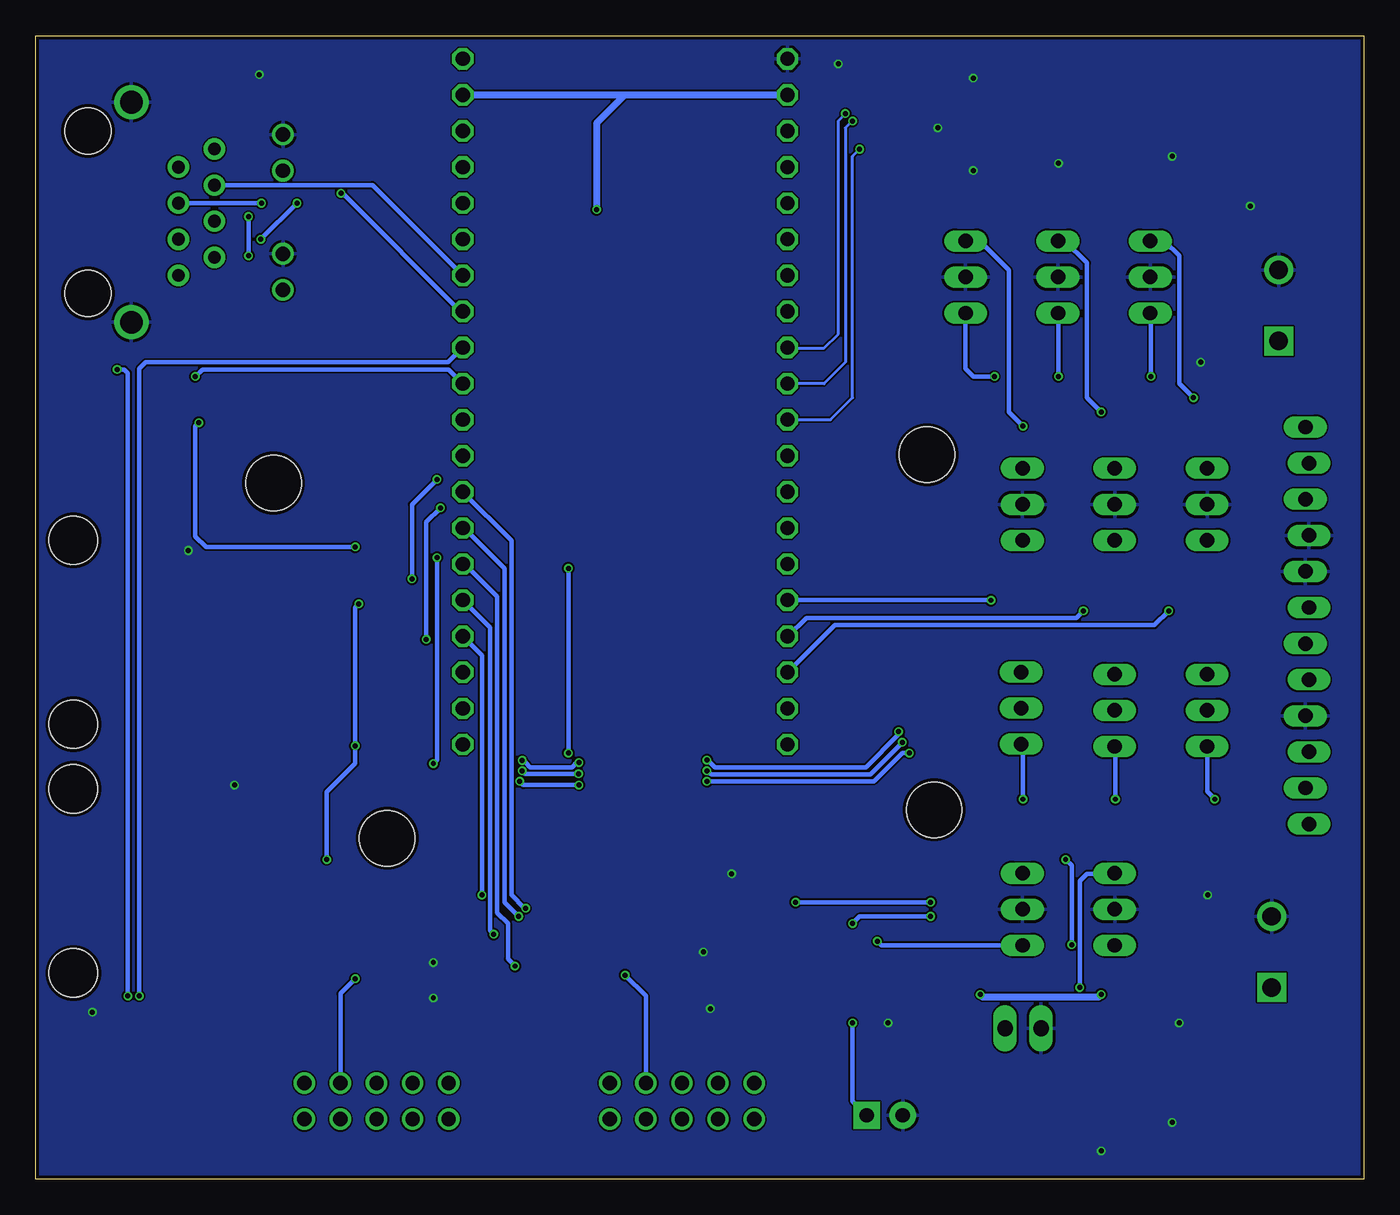
[diagram p5: board, bottom side, seen from below]

Size 93.5 x 80.5 mm. Coordinates in mm from the lower left corner, seen from the top.
Outline: 0,0 93.5,0 93.5,80.5 0,80.5 0,0
Copper layers (1*16): Top 0.018mm / dielectric 1.55mm / Bottom 0.018mm
Design rules "eC_2Layer_PClass7_BaseCopperO18": minimum track width 0.125mm, minimum drill 0.35mm, track to track 0.125mm, track to pad 0.125mm, pad to pad 0.125mm, via to via 0.125mm, smd to smd 0mil, copper to edge 0.25mm, drill to drill 0.35mm, minimum pad ring 0.175mm, minimum via ring 0.125mm, stop-mask expansion 0mil, vias tented up to drill 0.45mm, thermal gap 0.2mm

### Footprints (pad centres in the part's own frame; a part is rotated, then mirrored left to right if it is on the bottom)
SPARKFUN-BOARDS_DIL40_0.9 = drill 1 pad 1.397 octagon: 1 -22.86,-11.43; 2 -20.32,-11.43; 3 -17.78,-11.43; 4 -15.24,-11.43; 5 -12.7,-11.43; 6 -10.16,-11.43; 7 -7.62,-11.43; 8 -5.08,-11.43; 9 -2.54,-11.43; 10 0,-11.43; 11 2.54,-11.43; 12 5.08,-11.43; 13 7.62,-11.43; 14 10.16,-11.43; 15 12.7,-11.43; 16 15.24,-11.43; 17 17.78,-11.43; 18 20.32,-11.43; 19 22.86,-11.43; 20 25.4,-11.43; 21 25.4,11.43; 22 22.86,11.43; 23 20.32,11.43; 24 17.78,11.43; 25 15.24,11.43; 26 12.7,11.43; 27 10.16,11.43; 28 7.62,11.43; 29 5.08,11.43; 30 2.54,11.43; 31 0,11.43; 32 -2.54,11.43; 33 -5.08,11.43; 34 -7.62,11.43; 35 -10.16,11.43; 36 -12.7,11.43; 37 -15.24,11.43; 38 -17.78,11.43; 39 -20.32,11.43; 40 -22.86,11.43
0603 = smd 1.1 x 1: 1 -0.85,0; 2 0.85,0
C0603 = smd 1.1 x 1: 1 -0.85,0; 2 0.85,0
C0805 = smd 1.3 x 1.5: 1 -0.95,0; 2 0.95,0
LED-0603 = smd 1 x 1: A -0.877,0; C 0.877,0
TO220AV = drill 1.016 long: B -2.54,-2.54; C 0,-2.54; E 2.54,-2.54
1X12_LOCK_LONGPADS = drill 1.016 long: 1 0,0.127; 2 2.54,-0.127; 3 5.08,0.127; 4 7.62,-0.127; 5 10.16,0.127; 6 12.7,-0.127; 7 15.24,0.127; 8 17.78,-0.127; 9 20.32,0.127; 10 22.86,-0.127; 11 25.4,0.127; 12 27.94,-0.127
MOLEX-1X2 = drill 1.016 pad 1.88 square: 1 0,0 | drill 1.016 pad 1.88: 2 2.54,0
SCREWTERMINAL-5MM-2 = drill 1.3 pad 2.032 square: 1 0,0 | drill 1.3 pad 2.032: 2 5,0
SOIC08-FAIRCHILD = smd 0.61 x 1.52: 1 -1.905,-2.723; 2 -0.635,-2.723; 3 0.635,-2.723; 4 1.905,-2.723; 5 1.905,2.723; 6 0.635,2.723; 7 -0.635,2.723; 8 -1.905,2.723
SOT23-3 = smd 0.8 x 0.9: 1 -0.95,-1; 2 0.95,-1; 3 0,1.1
TO252 = smd 1 x 1.6: 1 -2.28,-4.8; 2 2.28,-4.8 | smd 5.4 x 6.2: 3 0,2.5
TO220V = drill 1.016 long: 1 -2.54,-2.54; 2 0,-2.54; 3 2.54,-2.54
QFN24-3X3 = smd 0.495 x 0.25: 1 -1.552,1; 6 -1.552,-1; 13 1.552,-1; 18 1.552,1 | smd 0.6 x 0.25: 2 -1.5,0.6; 3 -1.5,0.2; 4 -1.5,-0.2; 5 -1.5,-0.6; 14 1.5,-0.6; 15 1.5,-0.2; 16 1.5,0.2; 17 1.5,0.6 | smd 0.25 x 0.495: 7 -1,-1.552; 12 1,-1.552; 19 1,1.552; 24 -1,1.552 | smd 0.25 x 0.6: 8 -0.6,-1.5; 9 -0.2,-1.5; 10 0.2,-1.5; 11 0.6,-1.5; 20 0.6,1.5; 21 0.2,1.5; 22 -0.2,1.5; 23 -0.6,1.5
STANDOFF-HOLE = hole 3.9: 0,0
15-91-05 = smd 1.651 x 5.334: 1 -5.08,-10.795; 2 -2.54,-10.795; 3 0,-10.795; 4 2.54,-10.795; 5 5.08,-10.795 | hole 3.404: -6.477,0.838; 6.477,0.838
32005-400 = smd 3.1 x 0.5: 1 3,1.6; 2 3,0.8; 3 3,0; 4 3,-0.8; 5 3,-1.6 | smd 2.5 x 2: M1 -3,-4.45; M2 -3,4.45 | smd 3.3 x 2: M3 2.9,4.45; M4 2.9,-4.45
70553-02 = drill 1.092 long: 1 -1.27,-7.62; 2 1.27,-7.62
SI-50170 = drill 0.9 pad 1.5: 1 4.445,5.842; 2 3.175,3.302; 3 1.905,5.842; 4 0.635,3.302; 5 -0.635,5.842; 6 -1.905,3.302; 7 -3.175,5.842; 8 -4.445,3.302 | drill 1.016 pad 1.5: A1 -5.461,10.668; A2 2.921,10.668; C1 -2.921,10.668; C2 5.461,10.668 | drill 1.6 pad 2.2: S1 -7.747,0; S2 7.747,0 | hole 3.251: -5.715,-3.048; 5.715,-3.048
PAK100/2500-10 = drill 1 pad 1.422: 1 -5.08,-1.27; 2 -5.08,1.27; 3 -2.54,-1.27; 4 -2.54,1.27; 5 0,-1.27; 6 0,1.27; 7 2.54,-1.27; 8 2.54,1.27; 9 5.08,-1.27; 10 5.08,1.27

### Placement (x,y rotation side)
A1  52,56 270 top
C1  33,14.5 0 top
C2  72,76.75 0 top
C3  29.5,76 270 top
C4  25,71.5 0 top
C5  76,76.75 0 top
C6  35.5,77 90 top
C11  5.5,69 0 top
C12  41.5,22 0 top
C13  15.5,11.5 180 top
C14  15,75 270 top
D1  16.99,3.1 270 top
D2  19.5,73.5 270 top
D3  12,18 90 top
D4  11,59.5 270 top
FQP30N06L  8.5,33 90 top
J1  4,25 90 top
J2  35,4.5 180 top
J3  6,59 90 top
J4  6.5,13.5 90 top
OK3  66.5,14.75 270 top
OK4  48,15 270 top
Q1  8.5,47.5 90 top
Q2  71,29.75 270 top
Q3  25.5,63.5 90 top
Q4  15,47.5 90 top
Q5  19,63.5 90 top
Q6  21.5,47.5 90 top
Q7  71,43 270 top
Q8  73.75,20.5 270 top
Q9  71,38.75 270 top
Q10  12.5,63.5 90 top
Q11  15,19 90 top
Q15  21.6,33.16 90 top
Q16  15,33 90 top
R1  11.25,25.75 180 top
R2  24.25,25.75 180 top
R3  17.75,25.75 180 top
R4  29,14.5 0 top
R5  17,7 90 top
R6  11.25,40.5 180 top
R7  19.5,77 90 top
R8  12,14 270 top
R9  11,64 90 top
R10  29,12.5 180 top
R11  26.5,55.5 180 top
R12  17.5,40.5 180 top
R13  21.5,55.5 180 top
R14  24,40.5 180 top
R15  16.5,55.5 180 top
R16  33,12.5 180 top
R17  12,22.5 90 top
R18  32,76 90 top
R19  21.5,77 270 top
R21  59.5,16.25 0 top
R22  41.5,16.5 0 top
R23  59.5,13.25 0 top
R24  41.5,13.5 0 top
R25  55,13.5 0 top
R27  55,16.5 0 top
R28  73.5,13.25 0 top
R29  73.5,16.25 0 top
R31  71,33.5 180 top
R32  68,29.75 90 top
R33  68,43 90 top
R34  71,47 180 top
R35  68.01,38.76 90 top
R36  78.3,13.51 180 top
R37  70,19 180 top
R38  71,35.75 180 top
R39  70,53.5 0 top
R40  70,51 0 top
T1  8,5 90 top
T2  21.5,19 90 top
T3  7,75 90 top
U2  25,76 0 top
U$1  [STANDOFF-HOLE]  30.75,51 0 top
U$2  [STANDOFF-HOLE]  30.25,26 0 top
U$3  [STANDOFF-HOLE]  68.75,24 0 top
U$4  [STANDOFF-HOLE]  76.75,49 0 top
U$5  [ROBOBUZZ_1.2X]  50.25,43.5 0 top
X1  90,21 270 top
X2  90,38.5 270 top
X3  87,6.75 90 top
X4  24,3 180 top
X5  86.75,68.06 90 top
X7  69.5,5.5 0 top
X8  48,5.5 0 top

### Tracks (layer width: path | path; a pad name or v marks a point on that pad's centre or on a via)
1S1  (via drill 0.35)
  Top 0.3: R6.1 13.25,40.5 v13.75,40
  Bottom 0.3: v13.75,40 14.75,39 37.25,39 A1.18
1S1O
  Top 0.3: J1.7 7.99,40.24 9.25,41.5 9.25,44.52 9.24,44.53 9.24,47.93 9.25,47.94 9.25,48.75 10.54,50.04 Q1.E
1S2  (via drill 0.35)
  Top 0.3: R12.1 19.25,40.5 v19.75,40
  Bottom 0.3: v19.75,40 20.25,39.5 39.25,39.5 40.53,38.22 A1.17
1S2O
  Top 0.3: Q4.E 17.5,50 17,50 15.75,48.75 15.75,47.94 15.74,47.93 15.74,44.53 15.75,44.52 15.75,38.75 14.7,37.7 J1.6
1S3  (via drill 0.35)
  Top 0.3: R14.1 25.1,40.75 v26.25,40.75
  Bottom 0.3: v26.25,40.75 v26.26,40.76 A1.16
1S3O
  Top 0.3: J1.5 5.96,37.25 20.75,37.25 22,38.5 22,49 23.04,50.04 Q6.E
2S1
  Top 0.3: R11.1 38,55.5 39,56.5 39,62 40.57,63.57 A1.7
2S1O  (via drill 0.35)
  Top 0.3: v24,53 8.5,53 6,50.5 6,49 4.86,47.86 J1.10
  Bottom 0.3: Q3.E 28,66 27,66 25,64 25,54 v24,53
2S2
  Top 0.3: R13.1 23.93,57.08 27.43,57.08 28.5,56 37.9,56 38.45,56.55 38.45,64.04 A1.6
2S2O  (via drill 0.35)
  Top 0.3: J1.11 3.9,50.4 7.5,54 v18.5,54
  Bottom 0.3: v18.5,54 19.5,55 19.5,64.5 21.04,66.04 Q5.E
2S3
  Top 0.3: A1.5 40.2,68.7 38,66.5 38,57 37.5,56.5 28.6,56.5 27.6,57.5 21.5,57.5 20.5,56.5 18.35,56.5 R15.1
2S3O  (via drill 0.35)
  Top 0.3: v12,55 6.19,55 J1.12
  Bottom 0.3: Q10.E 14.04,66.04 13,65 13,56 v12,55
+3V3  (via drill 0.35)
  Top 0.3: R33.2 68.1,43.95 Q7.1 | R35.2 69.91,39.61 Q9.1 70.45,39.7 70.75,40 v70.75,40.5 70.75,43.2 Q7.1 | R37.2 70.4,20.25 71.5,20.25 72.7,21.45 Q8.1 72.75,22.25 v73,22.5 | R32.2 68.1,30.7 Q2.1 70.8,30.7 v71,30.5 | Q7.1 70.55,44.5 v71,44.5
  Bottom 0.3: v71,44.5 81.5,44.5 82.25,45.25 82.25,53 v82,53.25 | v73,22.5 73,27.25 71,29.25 v71,30.5 71,40.25 v70.75,40.5
  pour Top: 78,70.5 80,68.5 80,54 81.5,52.5 108.5,52.5 108.5,87 10,87 10,71 10.5,70.5
+5V  (via drill 0.35)
  Top 0.5: C6.1 40.4,76.15 A1.2
  Bottom 0.5: 52,76.32 54,74.32 v54,68.25 | A1.39 52,76.32 | 52,76.32 A1.2
  pour Top: 10.5,-2 10.5,8.5 11,9 35.5,9 38,11.5 38,68.5 39,69.5 77.5,69.5 79,68 79,53.5 81,51.5 102.5,51.5 102.5,-2
+12V
  pour Top: 9,82 9,70.5 10,69.5 36,69.5 37,68.5 37,11.25 35,10 10.5,10 9.5,9 9.5,-2.5 9,-3 -2,-3 -2,82
+24V  (via drill 0.35)
  Top 0.5: J4.1 11.65,13.5 R8.2 18.35,13.15 v18.5,13 | v27,13 27.65,13 R10.2
  Bottom 0.5: v27,13 26.82,12.82 18.68,12.82 v18.5,13
BATTIN
  Top 0.5: R10.1 R16.2 C1.1 32.27,14.5 33.15,15.38 34.38,15.38 35,16 35,18.5 35.5,19 37,19 37.5,19.5 37.5,30 38,30.5 40.47,30.5 A1.20
BLUE  (via drill 0.35)
  Top 0.3: v46.25,28 55,28 v55.25,27.75 | v59.42,28 62.25,28 63.43,29.18 A1.21 | v32,30 29,30 25.25,26.5 25.25,26.25 25.1,26.1 R2.1
  Bottom 0.3: v55.25,27.75 59.17,27.75 v59.42,28 | v46.25,28 34.5,28 32.5,30 v32,30
BLUE_OUT
  Top 0.5: Q15.E 24.09,35.75 23,35.75 22,34.75 22,29.5 20.95,28.45 17.42,28.45 16.47,27.5 7.5,27.5 5,25 J1.1
D+  (via drill 0.35)
  Top 0.3: X3.3 v87,12.9 | v82.25,56.5 87.25,56.5 v87.75,57
  Bottom 0.3: A1.31 64.43,57 81.75,57 v82.25,56.5 | v87,12.9 87,56.75 87.25,57 v87.75,57
D-  (via drill 0.35)
  Top 0.3: X3.2 v86.2,12.9
  Bottom 0.3: A1.32 64.47,57.5 85.75,57.5 86.2,57.05 v86.2,12.9
ESTOP  (via drill 0.35)
  Top 0.3: Q11.B 17.58,16.5 v20.57,16.5 | v21,22.5 21.5,23 27,23 v30.5,19.5 | v62.08,20 59,20 58.5,19.5 v40,19.5
  Bottom 0.3: v20.57,16.5 20.57,22.07 v21,22.5 | v30.5,19.5 v40,19.5 | v62.08,20 62.08,36.87 A1.24
ETH_LED1
  Top 0.3: R39.2 75,53.5 76.08,54.58 X5.A1
ETH_LED2  (via drill 0.35)
  Top 0.3: R40.2 72.85,53 75.25,53 77.5,55.25 77.5,64 v78.5,65 | X5.A2 76.99,70.99 77,71 77.25,71 78.5,69.75 v78.5,67.75
  Bottom 0.3: v78.5,65 v78.5,67.75
GND  (via drill 0.35)
  Top 0.2: C3.2 29.5,74.5 v30,74 | v27.5,71 26.35,71 C4.2 25.6,71.75 U2.11 25.55,74.55 25.55,74.89 25.42,75.03 24.98,75.03 24.85,74.89 24.85,74.55 U2.9 | U2.20 25.65,77.45 25.65,77.21 25.86,77 U2.18 27,77 v27.5,77.5
  Top 0.3: D2.C 20.62,71.5 v21.5,71.5 | 12.78,72.72 T3.1 | 12.78,72.72 v13.5,72 | C14.2 14.95,74 13.5,74 12.78,73.28 12.78,72.72 | C13.2 13.5,11.5 v13,11 | C11.2 7.5,69 v8,68.5 | D4.C 11,58 v11.5,57.5 | D3.C 12,19 v11,20 | D1.C 18.28,2.22 v18.5,2 | T1.1 13.5,3.42 v13.5,4 | C12.2 44,22 v44.5,21.5 | C2.2 73.62,77.53 76.08,77.53 C5.2 77.75,77.65 v77.75,77.75 | X2.1 82.08,43.58 v82.75,44.25 | X3.5 89.5,10.65 v89.5,11.75 | X1.1 79.5,26.38 v79.5,27.75
  Top 0.4: OK4.4 46,12.37 v46,12 | OK4.2 46.13,15.63 v46.5,16 | OK3.2 65.36,15.38 v65.5,15.25 | OK3.4 65.41,12.85 v65.5,12.75
  Top 0.5: C6.2 36.35,77.85 v37,78.5 | C1.2 R16.1 33.85,11.35 v33.5,11
  pour Bottom: -5.5,83.5 105.5,83.5 105.5,-3.5 -5.5,-3.5
GREEN  (via drill 0.35)
  Top 0.3: R3.1 20.35,27.5 25.5,27.5 28.75,30.75 v32.5,30.75 | v46.25,28.75 55.06,28.75 v55.28,28.53 | v59.25,28.75 61.25,28.75 62.25,29.75 62.25,32.25 63.14,33.14 A1.22
  Bottom 0.3: v32.5,30.75 34.75,28.5 45.94,28.5 46.01,28.57 46.08,28.57 v46.25,28.75 | v55.28,28.53 59.03,28.53 v59.25,28.75
GREEN_OUT
  Top 0.5: J1.2 5.59,29 13.75,29 15.25,30.5 15.25,33.75 17.04,35.54 Q16.E
GYRO_INT  (via drill 0.35)
  Top 0.2: U2.12 26,73 26.5,72.5 v35.5,72.5
  Bottom 0.2: A1.11 37.54,53.46 36,55 36,72 v35.5,72.5
L+12V
  Top 0.3: X7.2 X7.1 64.42,4.08 65.5,3 68.27,3 X7.5 X7.7 73.27,3 76,3 77,4 77,10.6 R28.2 R29.2
LALI
  Top 0.3: OK3.8 72.25,16.66 R29.1 | 68.91,16.66 67.5,15.25 67.5,9 69.5,7 X7.6
  Top 0.4: 68.91,16.66 OK3.8
LBLI  (via drill 0.35)
  Top 0.3: OK3.6 v71,14.12 71.78,14.12 R28.1
  Bottom 0.3: 72,6.81 X7.8 72.04,13.07 v71,14.12
LDIR  (via drill 0.35)
  Top 0.3: v59.75,15 59.75,14.35 R23.1
  Bottom 0.3: A1.26 63.3,43.3 61,41 61,18.75 60.25,18 60.25,15.5 v59.75,15
LEA
  Top 0.3: R31.1 71.85,30 Q2.3 74.5,29.75 76,28.25 76,21.5 76.5,21 X1.3
LEA3  (via drill 0.35)
  Top 0.3: Q2.2 68.1,28.8 R32.1 65.85,28.9 v65.5,29.25 | v65.25,43.75 64.5,44.5 63,44.5 61.66,45.84 A1.14
  Bottom 0.3: v65.5,29.25 65.25,29.5 v65.25,43.75
LEB
  Top 0.3: R36.1 79.2,13.56 X1.5 79.12,16 76.5,16 74.85,17.65 Q8.3
LEB3  (via drill 0.35)
  Top 0.3: Q8.2 71.4,19.55 R37.1 70.59,19 69.81,18.23 68.49,18.23 68.33,18.39 68.33,19.18 67.5,20 67,20 64,23 57.25,23 56,24.25 v56,30 | A1.15 55.7,43.3 v56,43
  Bottom 0.3: v56,43 v56,30
LGND
  Top 0.3: OK3.7 68.58,14.74 68.33,14.74 68.14,14.55 68.14,13.68 68.33,13.48 68.58,13.48 OK3.5 69.32,12.75 71.5,12.75 74.58,9.67 X7.10 X7.9
LSPEED  (via drill 0.35)
  Top 0.3: R21.1 59.65,17.25 v61.25,17.25
  Bottom 0.3: v61.25,17.25 61.5,17.5 61.5,38.83 A1.25
N$1  (via drill 0.35)
  Top 0.3: T2.3 27.46,21.54 v30.5,18.5 28.15,16.15 R4.1 | v36,11 v36,18
  Bottom 0.3: v30.5,18.5 35.5,18.5 v36,18 | J2.1 36,5.5 v36,11
N$2
  Top 0.2: C4.1 25.2,72.55 U2.10
N$3  (via drill 0.35)
  Top 0.3: v10.5,26.75 10.5,25.85 R1.2
  Bottom 0.3: FQP30N06L.B 11.04,27.29 v10.5,26.75
N$4  (via drill 0.35)
  Top 0.3: R2.2 24,26.35 v24,26.75
  Bottom 0.3: Q15.B 24,30.48 v24,26.75
N$5
  Top 0.3: R5.1 D1.A
N$6
  Top 0.3: D2.A R7.1
N$8  (via drill 0.35)
  Top 0.3: R17.1 17.43,21.65 Q11.E | v20,13.5 24.5,13.5 25.27,12.73 X4.1
  Bottom 0.3: Q11.E 17.58,21.5 19.5,21.5 20,21 v20,13.5
N$9
  Top 0.3: R8.1 D3.A
N$10  (via drill 0.35)
  Top 0.3: v17.5,26.75 16.9,26.15 R3.2
  Bottom 0.3: Q16.B 17.5,30.42 v17.5,26.75
N$11
  Top 0.3: Q6.B 23.15,44.07 R14.2
N$12
  Top 0.3: R9.1 D4.A
N$13
  Top 0.3: Q4.B 16.65,44.07 R12.2
N$14
  Top 0.3: Q1.B 10.4,44.32 R6.2
N$15  (via drill 0.35)
  Top 0.3: R11.2 25.65,56.15 v26,56.5
  Bottom 0.3: v26,56.5 27.5,56.5 28.04,57.04 Q3.B
N$16  (via drill 0.35)
  Top 0.3: v21.5,56.5 20.65,55.65 R13.2
  Bottom 0.3: Q5.B 21.5,60.92 v21.5,56.5
N$28  (via drill 0.35)
  Top 0.3: v15,56.5 15.65,55.85 R15.2
  Bottom 0.3: Q10.B 15,60.92 v15,56.5
N$29
  Top 0.3: R21.2 60.76,16.66 OK3.1
N$30
  Top 0.3: OK4.1 43.41,16.91 43,16.5 R22.2
N$31
  Top 0.3: R24.2 43.22,14.37 OK4.3
N$32
  Top 0.3: R23.2 61.22,14.12 OK3.3
N$37
  Top 0.3: R39.1 63.47,53.5 A1.30
N$38
  Top 0.3: R40.1 63.51,51 A1.29
R+12V
  Top 0.3: R27.2 R25.2 55.85,3.85 55,3 51.77,3 X8.7 X8.5 48,4 47,3 43.5,3 42.92,3.58 X8.1 X8.2
RALI
  Top 0.3: R27.1 53.74,16.91 OK4.8 49.91,16.91 49,16 49,7.77 X8.6
RBLI  (via drill 0.35)
  Top 0.3: OK4.6 v52,14.37 53.28,14.37 R25.1
  Bottom 0.3: X8.8 50.54,12.9 v52,14.37
RD+  (via drill 0.35)
  Top 0.3: A1.35 75.06,66.16 v77.6,68.7
  Bottom 0.3: v77.6,68.7 X5.4
RD-  (via drill 0.35)
  Top 0.3: X5.6 v77.64,66.16 | v75.1,68.7 A1.36
  Bottom 0.3: v77.64,66.16 v75.1,68.7
RDIR  (via drill 0.35)
  Top 0.3: v59,19.07 58.92,19 41,19 39.5,17.5 39.5,14.65 R24.1
  Bottom 0.3: A1.28 60,44.95 60,20 59.08,19.07 v59,19.07
REA
  Top 0.3: R34.1 72.1,46.75 Q7.3 74.25,43 75.25,42 75.25,39.5 76.25,38.5 X2.3
REA3  (via drill 0.35)
  Top 0.3: Q7.2 68.1,42.05 R33.1 67.1,42.15 v67,42.25 | A1.12 41.99,49.5 65,49.5 v65.25,49.25
  Bottom 0.3: v65.25,49.25 67,47.5 v67,42.25
REB
  Top 0.3: Q9.3 72.1,36 R38.1 75,35.75 77.33,33.42 X2.5
REB3  (via drill 0.35)
  Top 0.3: Q9.2 68.12,37.8 R35.1 66.09,37.91 v66,38 | A1.13 41.7,47.25 v65,47.25
  Bottom 0.3: v65,47.25 66,46.25 v66,38
RED  (via drill 0.35)
  Top 0.3: A1.23 61.75,34 61.75,30 61,29.25 60.77,29.48 v59.25,29.48 | v55.25,29.32 55.08,29.5 v46.25,29.5 | v32.75,31.5 32.58,31.32 28.47,31.32 25.07,27.93 17.64,27.93 15.46,25.75 R1.1
  Bottom 0.3: v59.25,29.48 59.1,29.32 59.01,29.32 58.69,29 55.75,29 55.42,29.32 v55.25,29.32 | v46.25,29.5 46.08,29.32 46.01,29.32 45.69,29 35.06,29 32.75,31.31 v32.75,31.5
RED_OUT
  Top 0.5: J1.3 7.83,30.08 8.75,31 8.75,34.25 10.04,35.54 FQP30N06L.E
RGND
  Top 0.3: OK4.7 50.03,14.95 49.85,14.95 49.69,14.78 49.69,13.95 49.85,13.79 50.03,13.79 OK4.5 52.41,13.1 53.08,12.42 X8.10 X8.9
RSPEED  (via drill 0.35)
  Top 0.3: R22.1 42.65,18.5 v59.5,18.5
  Bottom 0.3: A1.27 63.34,45.84 60.5,43 60.5,19.5 v59.5,18.5
SAFETY_LIGHT  (via drill 0.35)
  Top 0.3: A1.19 38.64,33.14 36.98,31.48 36.98,20 36.5,19.52 35.28,19.52 35.26,19.5 35.25,19.5 34.48,18.73 34.48,16.98 v34.25,16.75
  Bottom 0.3: T2.1 33.96,16.46 v34.25,16.75
SCL  (via drill 0.35)
  Top 0.2: U2.23 24.4,77.9 25,78.5 32.5,78.5 33,78 33,76.04 34.02,75.02 | 34.02,75.02 34.56,74.47 v36,74.47 | R18.1 33.89,75.15 34.02,75.02
  Bottom 0.2: v36,74.47 36.02,74.47 36.5,74 36.5,57.5 38,56 A1.10
SDA  (via drill 0.35)
  Top 0.2: 24.05,77.6 U2.24 24,78.5 | v36.5,75 34.5,75 33.5,76 33.5,78.5 33,79 24.5,79 24,78.5 | R19.1 21.65,78 23.5,78 24,78.5
  Bottom 0.2: 40.53,58.5 38,58.5 37,59.5 37,74.5 v36.5,75
  Bottom 0.3: A1.9 40.53,58.5
TD+  (via drill 0.35)
  Top 0.3: X5.1 76.53,72.51 76.51,72.49 75.09,72.49 v72,69.39
  Bottom 0.3: A1.33 63.58,61.08 71.89,69.39 v72,69.39
TD-
  Bottom 0.3: A1.34 69.78,69.97 75.63,69.97 75.65,69.95 76.51,69.95 76.53,69.97 X5.3